# EasyEDA Pro project lubancat_extand.eprj

# Schematic Schematic1
Create Date: 2024-06-27; Page Name: P1; Project Name: lubancat_extand; Schematic Name: Schematic1; Update Date: 2024-06-27; Company: 嘉立创EDA; Page Size: A4; Version: V1.0
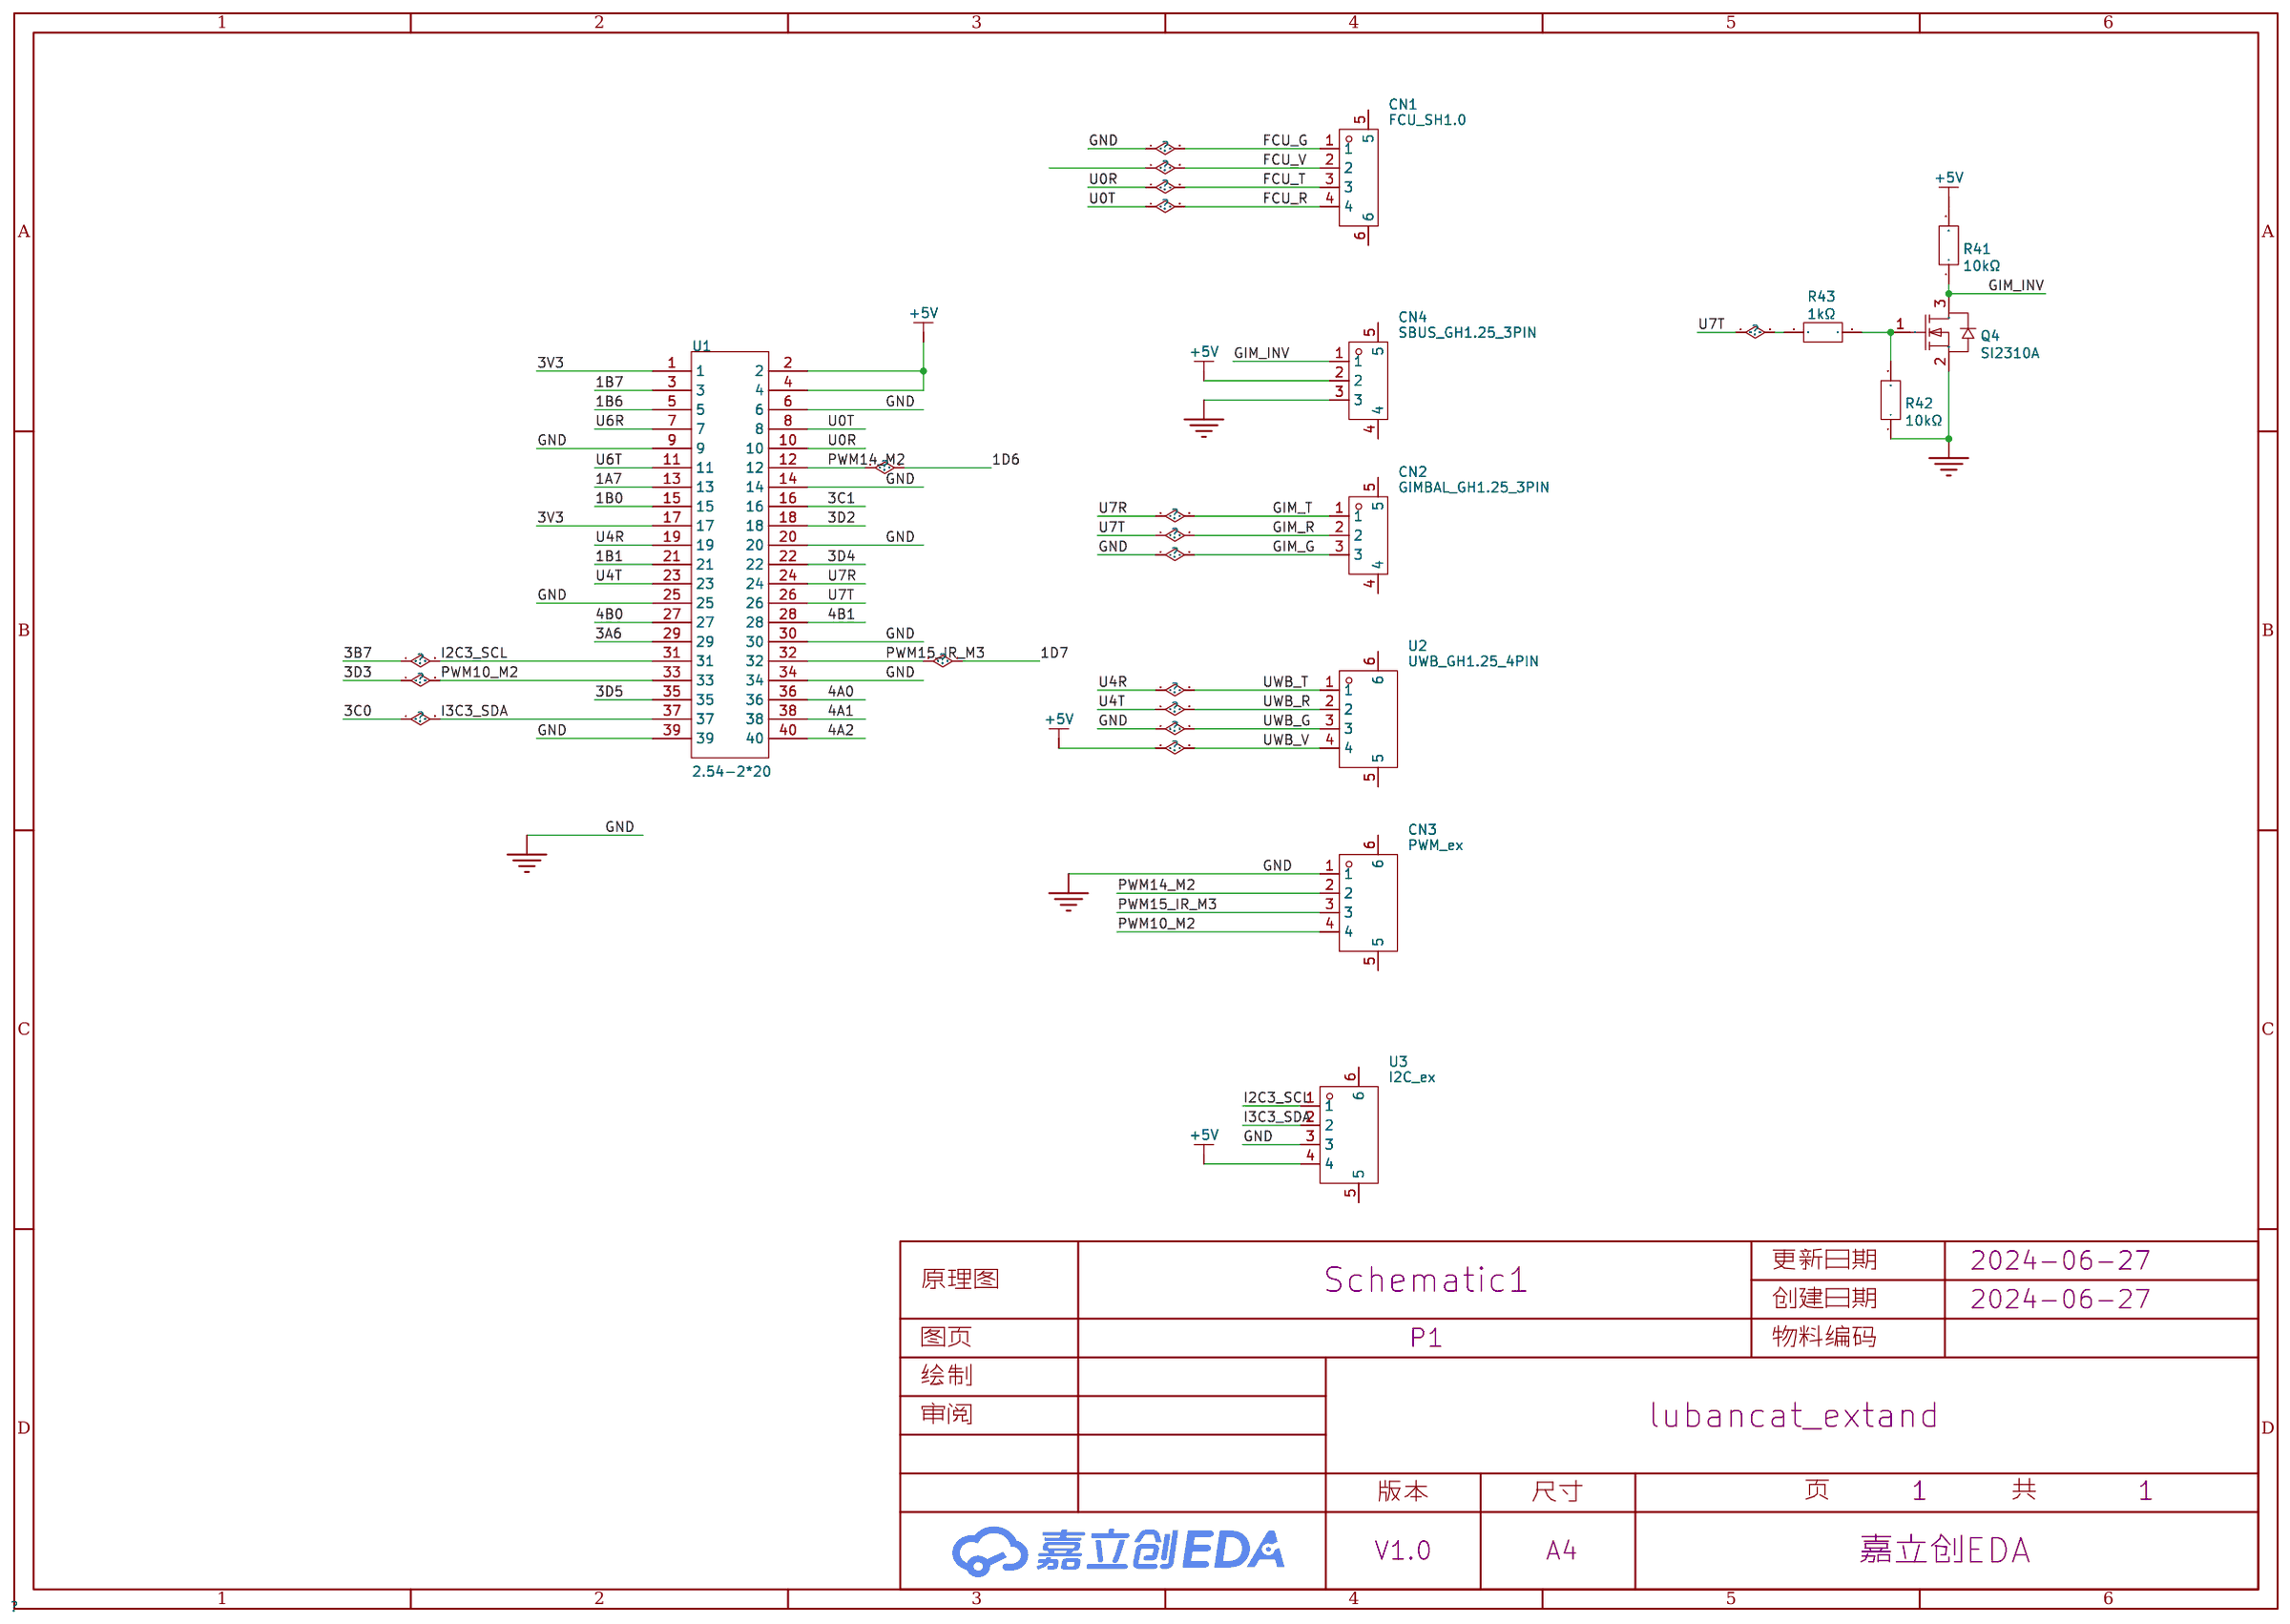
[diagram p0: schematic sheet]

## Parts
CN1  FCU_SH1.0  [CONN-SMD_4P-P1.00_WAFER-SH1.0-4PWB]
CN2  GIMBAL_GH1.25_3PIN  [CONN-TH_3P-P1.25_GH1.25]
CN3  PWM_ex  [CONN-SMD_4P-P1.25_XUNPU_WAFER-GH1.25-4PWB]
CN4  SBUS_GH1.25_3PIN  [CONN-TH_3P-P1.25_GH1.25]
Q4  SI2310A  [SOT-23-3_L2.9-W1.3-P0.95-LS2.4-BR]
R41  10kΩ  [R0603]
R42  10kΩ  [R0603]
R43  1kΩ  [R0603]
U1  2.54-2*20  [HDR-TH_40P-P2.54-V-F-R2-C20-S2.54]
U2  UWB_GH1.25_4PIN  [CONN-SMD_4P-P1.25_XUNPU_WAFER-GH1.25-4PWB]
U3  I2C_ex  [CONN-SMD_4P-P1.25_XUNPU_WAFER-GH1.25-4PWB]

## Library data of the parts
CN1 = WAFER-SH1.0-4PWB: 插针结构:1x4P;间距:1mm;安装方式:卧贴;总PIN数:4P;排数:1;每排PIN数:4;额定电流:1A;工作温度范围:-25℃~+85℃;; LCSC Part Name: 1x4P 间距:1mm 卧贴; Supplier Part: C3029343; Manufacturer: XUNPU(讯普); Supplier Footprint: SMD,P=1mm,卧贴; JLCPCB Part Class: 扩展库; Datasheet: https://atta.szlcsc.com/upload/public/pdf/source/20220527/1879B8210BD3B2006BCEAC1A40D397B6.pdf; Supplier: LCSC; Pins Structure: 1x4P; Pitch: 1mm; Mounting Style: 卧贴; Number of Pins: 4P; Number of Rows: 1; Number of PINs Per Row: 4; Current Rating (Max): 1A; Operating Temperature Range: -25℃~+85℃
CN2 CN4 = WAFER-GH1.25-3PWB: 插针结构:1x3P;间距:1.25mm;安装方式:卧贴;参考系列:GH;总PIN数:3P;排数:1;每排PIN数:3;额定电流:1A;工作温度范围:-25℃~+85℃;; LCSC Part Name: 1x3P 间距:1.25mm 卧贴 系列:GH; Supplier Part: C3029378; Manufacturer: XUNPU(讯普); Supplier Footprint: SMD,P=1.25mm,卧贴; JLCPCB Part Class: Extended Part; Datasheet: https://atta.szlcsc.com/upload/public/pdf/source/20220527/CB8773BFB0913C3B8ABD62CB38BA101A.pdf; Supplier: LCSC; Pins Structure: 1x3P; Pitch: 1.25mm; Mounting Style: 卧贴; Reference Series: GH; Number of Pins: 3P; Number of Rows: 1; Number of PINs Per Row: 3; Current Rating (Max): 1A; Operating Temperature Range: -25℃~+85℃
CN3 U2 U3 = WAFER-GH1.25-4PWB: 插针结构:1x4P;间距:1.25mm;安装方式:卧贴;参考系列:GH;总PIN数:4P;排数:1;每排PIN数:4;额定电流:1A;工作温度范围:-25℃~+85℃;; LCSC Part Name: 1x4P 间距:1.25mm 卧贴 系列:GH; Supplier Part: C3029379; Manufacturer: XUNPU(讯普); Supplier Footprint: SMD,P=1.25mm,卧贴; JLCPCB Part Class: 扩展库; Datasheet: https://atta.szlcsc.com/upload/public/pdf/source/20220527/CB8773BFB0913C3B8ABD62CB38BA101A.pdf; Supplier: LCSC; Pins Structure: 1x4P; Pitch: 1.25mm; Mounting Style: 卧贴; Reference Series: GH; Number of Pins: 4P; Number of Rows: 1; Number of PINs Per Row: 4; Current Rating (Max): 1A; Operating Temperature Range: -25℃~+85℃
Q4 = SI2310A: 类型:1个N沟道;漏源电压(Vdss):60V;连续漏极电流(Id):3A;功率(Pd):1.38W;导通电阻(RDS(on)@Vgs,Id):90mΩ@10V,3A;阈值电压(Vgs(th)@Id):3V@250uA;; LCSC Part Name: 1个N沟道 耐压:60V 电流:3A; Supplier Part: C347492; Manufacturer: UMW(友台半导体); Supplier Footprint: SOT-23; JLCPCB Part Class: Extended Part; Datasheet: https://atta.szlcsc.com/upload/public/pdf/source/20231109/99F3F4A41A969ECE105DCC94D74FAC1A.pdf; Supplier: LCSC; Type: 1个N沟道; Drain Source Voltage (Vdss): 60V; Continuous Drain Current (Id): 3A; Power Dissipation (Pd): 1.38W; Drain Source On Resistance (RDS(on)@Vgs,Id): 90mΩ@10V,3A; Gate Threshold Voltage (Vgs(th)@Id): 3V@250uA
R41 R42 = RC0603FR-0710KL: 电阻类型:厚膜电阻;阻值:10kΩ;精度:±1%;功率:100mW;最大工作电压:75V;温度系数:±100ppm/℃;; LCSC Part Name: 厚膜电阻 10kΩ ±1% 100mW; Supplier Part: C98220; Manufacturer: YAGEO(国巨); Supplier Footprint: 0603; JLCPCB Part Class: Extended Part; Datasheet: https://atta.szlcsc.com/upload/public/pdf/source/20180927/C295883_E8D83085EA81BD7DE0B2B681138C15EE.pdf; Supplier: LCSC; Type: 厚膜电阻; Tolerance: ±1%; Power(Watts): 100mW; Overload Voltage (Max): 75V; Temperature Coefficient: ±100ppm/℃; Operating Temperature Range: -55℃~+155℃
R43 = RC0603FR-071KL: 电阻类型:厚膜电阻;阻值:1kΩ;精度:±1%;功率:100mW;最大工作电压:75V;温度系数:±100ppm/℃;; LCSC Part Name: 厚膜电阻 1kΩ ±1% 100mW; Supplier Part: C22548; Manufacturer: YAGEO(国巨); Supplier Footprint: 0603; JLCPCB Part Class: Extended Part; Datasheet: https://atta.szlcsc.com/upload/public/pdf/source/20180316/70C0E2BDAE7FCC62C531A5A58D202EE1.pdf; Supplier: LCSC; Type: 厚膜电阻; Tolerance: ±1%; Power(Watts): 100mW; Overload Voltage (Max): 75V; Temperature Coefficient: ±100ppm/℃; Operating Temperature Range: -55℃~+155℃
U1 = 2.54-2*20: 插孔结构:2x20P;间距:2.54mm;行距:2.54mm;圆孔/方孔:方孔;安装类型:直插;排数:双排;总孔位数:40P;额定电流:2.5A;额定电压:-;插孔方向:顶部;塑高:8.5mm;工作温度范围:-40℃~+105℃;; LCSC Part Name: 间距:2.54mm 2x20P 直插; Supplier Part: C2977589; Manufacturer: ZHOURI(洲日); Supplier Footprint: 插件,P=2.54mm; JLCPCB Part Class: 扩展库; Datasheet: https://atta.szlcsc.com/upload/public/pdf/source/20220328/834E302BE3C038BBC5C70F5E02589B1E.pdf; Supplier: LCSC; Holes Structure: 2x20P; Pitch: 2.54mm; Row Spacing: 2.54mm; Circular Hole / Square Hole: 方孔; Mounting Type: 直插; Number of Rows: 双排; Number of Holes: 40P; Current Rating (Max): 2.5A; Holes Direction: 顶部; Insulation Height: 8.5mm; Operating Temperature Range: -40℃~+105℃

## Nets
3V3: U1.1 U1.17
+5V: CN4.2 R41.2 U1.2 U1.4 U2.4 U3.4
GND: CN1.1 CN2.3 CN3.1 CN4.3 Q4.2(S) R42.1 U1.6 U1.9 U1.14 U1.20 U1.25 U1.30 U1.34 U1.39 U2.3 U3.3
1A7: U1.13
1B0: U1.15
1B1: U1.21
1B6: U1.5
1B7: U1.3
1D6: CN3.2 U1.12
1D7: CN3.3 U1.32
3A6: U1.29
3B7: U1.31 U3.1
3C0: U1.37 U3.2
3C1: U1.16
3D2: U1.18
3D3: CN3.4 U1.33
3D4: U1.22
3D5: U1.35
4A0: U1.36
4A1: U1.38
4A2: U1.40
4B0: U1.27
4B1: U1.28
FCU_R: CN1.4 U1.8
FCU_T: CN1.3 U1.10
FCU_V: CN1.2
GIM_INV: CN4.1 Q4.3(D) R41.1
GIM_R: CN2.2 R43.2 U1.26
GIM_T: CN2.1 U1.24
U4R: U1.19 U2.1
U4T: U1.23 U2.2
U6R: U1.7
U6T: U1.11
$1N2704: Q4.1(G) R42.2 R43.1

Not connected (* = marked no-connect by the designer): CN1 5 6; CN2 4 5; CN3 5 6; CN4 4 5; U2 5 6; U3 5 6

# Schematic Schematic1_1
Create Date: 2024-06-27; Page Name: P1; Project Name: lubancat_extand; Schematic Name: Schematic1; Update Date: 2024-06-27; Company: 嘉立创EDA; Page Size: A4; Version: V1.0
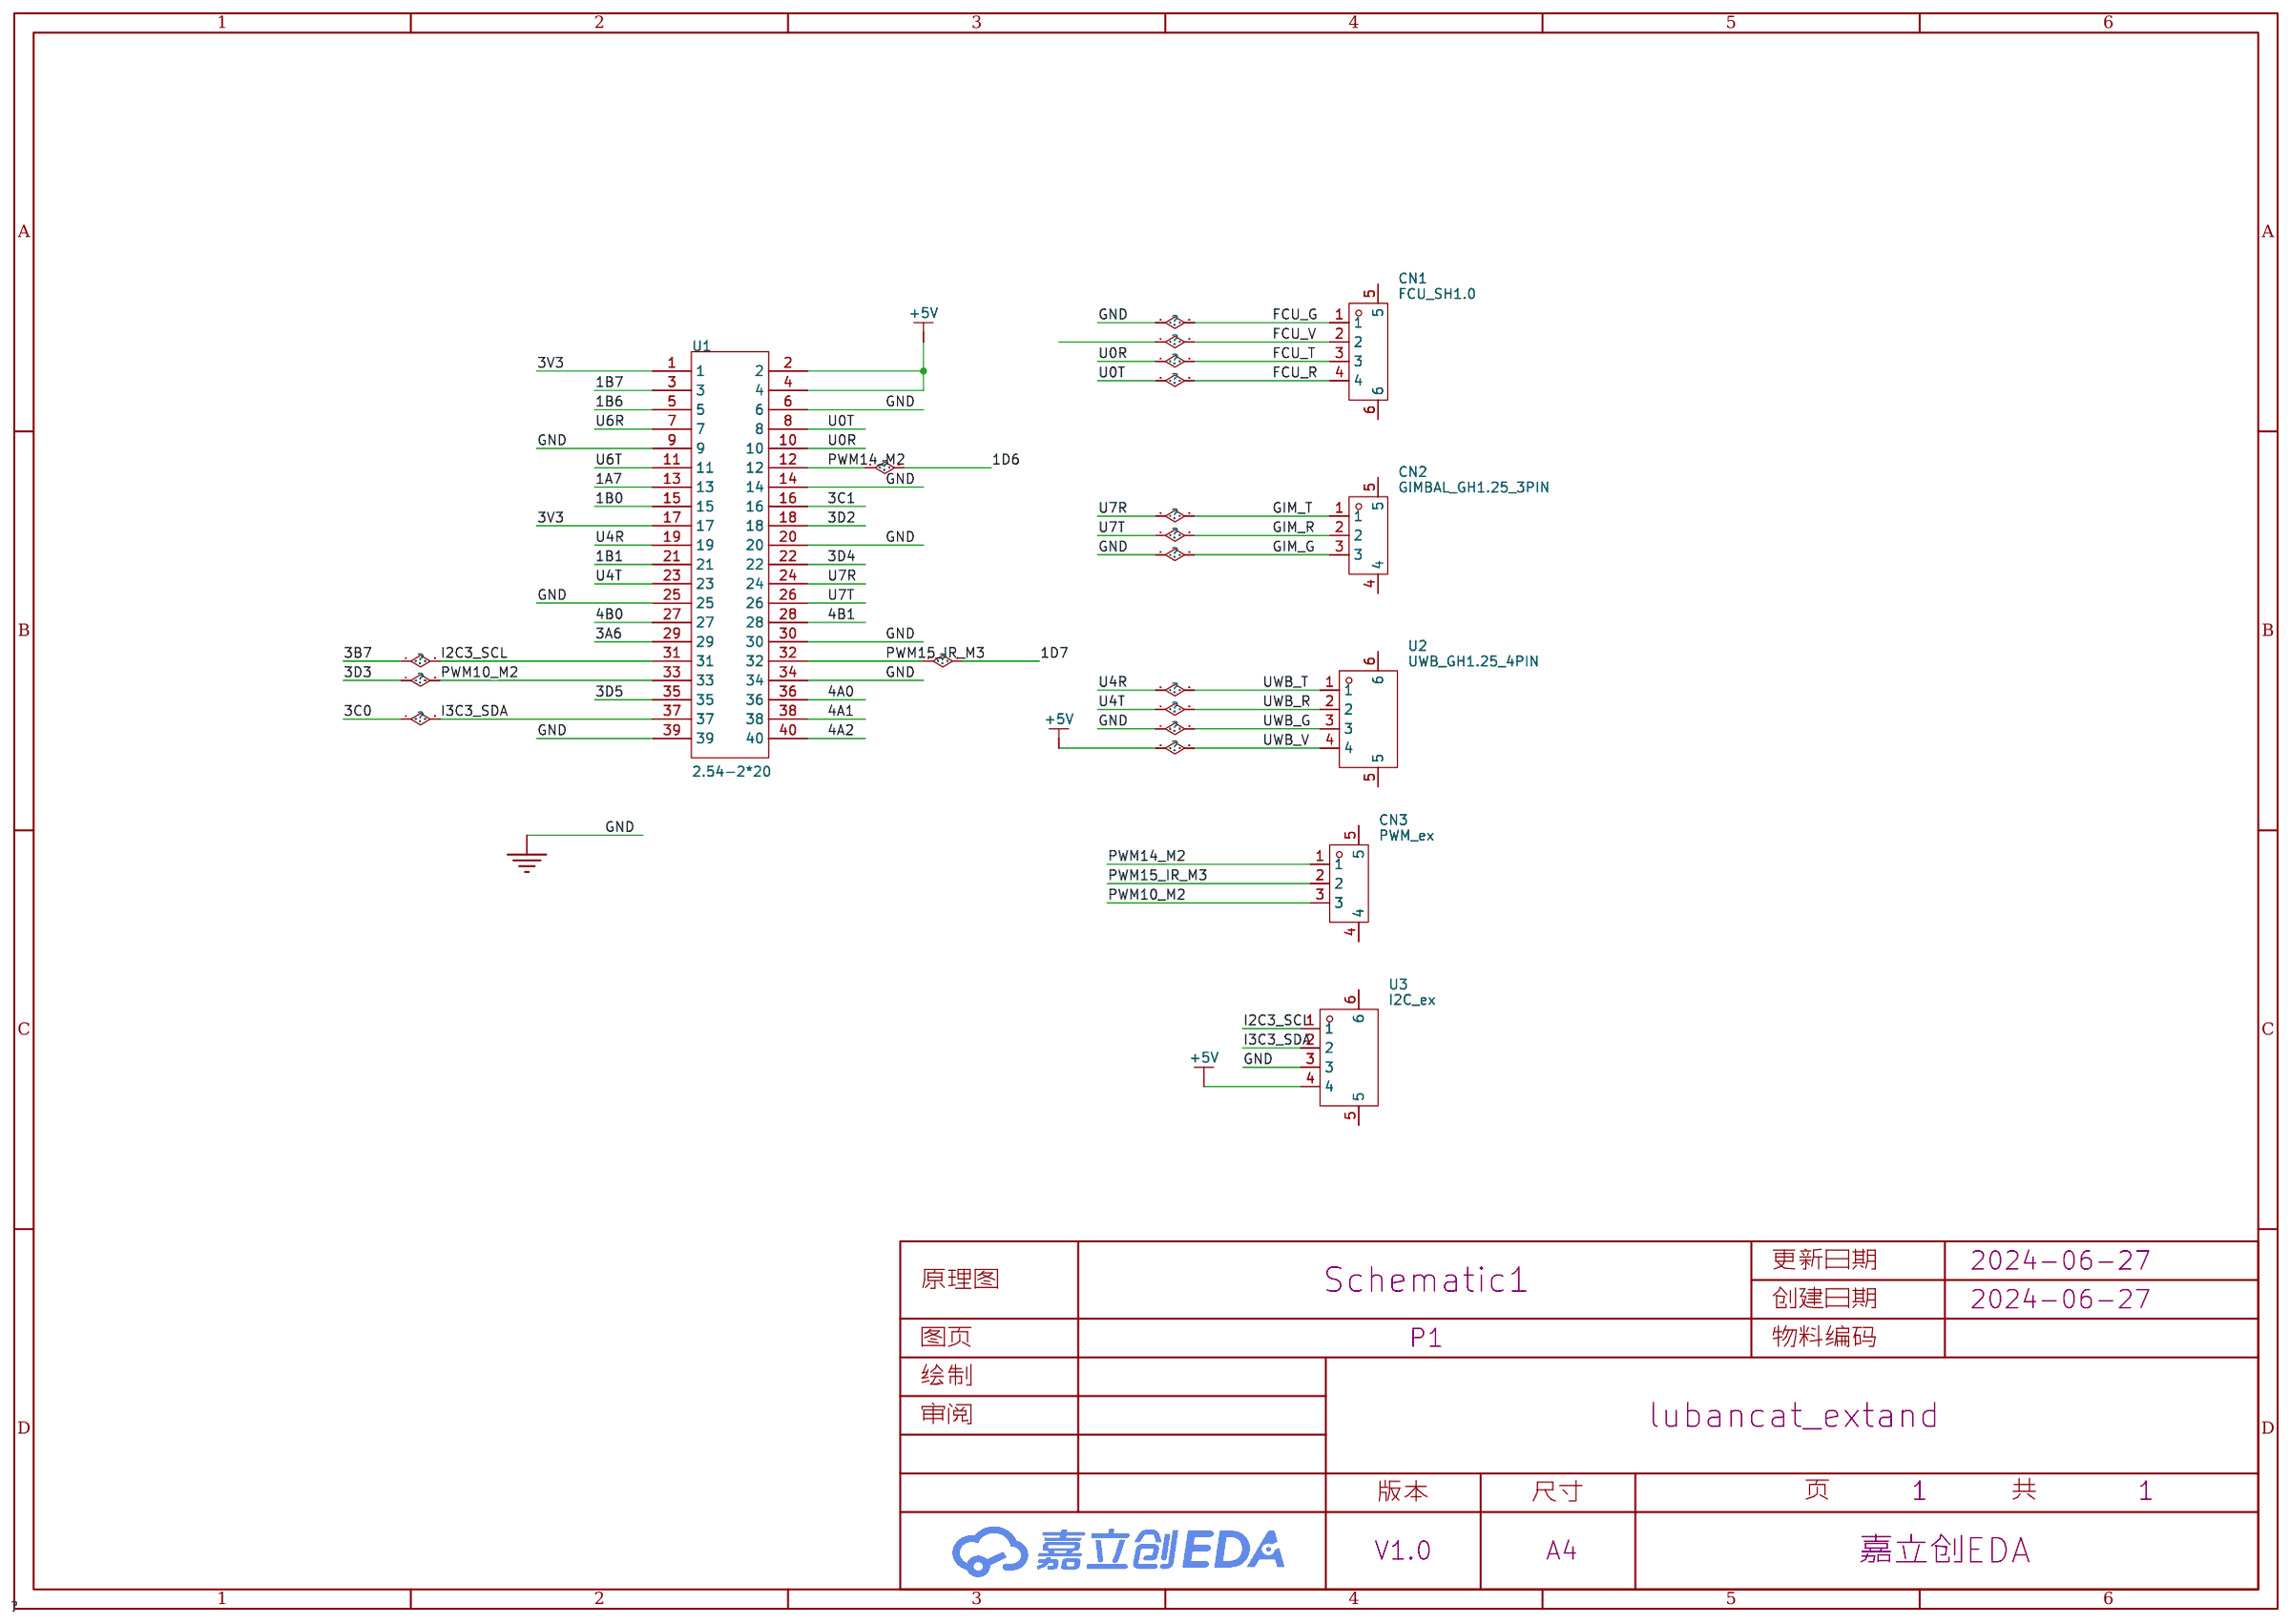
[diagram p1: schematic sheet]

## Parts
CN1  FCU_SH1.0  [CONN-SMD_4P-P1.00_WAFER-SH1.0-4PWB]
CN2  GIMBAL_GH1.25_3PIN  [CONN-TH_3P-P1.25_GH1.25]
CN3  PWM_ex  [CONN-TH_3P-P1.25_GH1.25]
U1  2.54-2*20  [HDR-TH_40P-P2.54-V-F-R2-C20-S2.54]
U2  UWB_GH1.25_4PIN  [CONN-SMD_4P-P1.25_XUNPU_WAFER-GH1.25-4PWB]
U3  I2C_ex  [CONN-SMD_4P-P1.25_XUNPU_WAFER-GH1.25-4PWB]

## Library data of the parts
CN1 = WAFER-SH1.0-4PWB: 插针结构:1x4P;间距:1mm;安装方式:卧贴;总PIN数:4P;排数:1;每排PIN数:4;额定电流:1A;工作温度范围:-25℃~+85℃;; LCSC Part Name: 1x4P 间距:1mm 卧贴; Supplier Part: C3029343; Manufacturer: XUNPU(讯普); Supplier Footprint: SMD,P=1mm,卧贴; JLCPCB Part Class: 扩展库; Datasheet: https://atta.szlcsc.com/upload/public/pdf/source/20220527/1879B8210BD3B2006BCEAC1A40D397B6.pdf; Supplier: LCSC; Pins Structure: 1x4P; Pitch: 1mm; Mounting Style: 卧贴; Number of Pins: 4P; Number of Rows: 1; Number of PINs Per Row: 4; Current Rating (Max): 1A; Operating Temperature Range: -25℃~+85℃
CN2 CN3 = WAFER-GH1.25-3PWB: 插针结构:1x3P;间距:1.25mm;安装方式:卧贴;参考系列:GH;总PIN数:3P;排数:1;每排PIN数:3;额定电流:1A;工作温度范围:-25℃~+85℃;; LCSC Part Name: 1x3P 间距:1.25mm 卧贴 系列:GH; Supplier Part: C3029378; Manufacturer: XUNPU(讯普); Supplier Footprint: SMD,P=1.25mm,卧贴; JLCPCB Part Class: Extended Part; Datasheet: https://atta.szlcsc.com/upload/public/pdf/source/20220527/CB8773BFB0913C3B8ABD62CB38BA101A.pdf; Supplier: LCSC; Pins Structure: 1x3P; Pitch: 1.25mm; Mounting Style: 卧贴; Reference Series: GH; Number of Pins: 3P; Number of Rows: 1; Number of PINs Per Row: 3; Current Rating (Max): 1A; Operating Temperature Range: -25℃~+85℃
U1 = 2.54-2*20: 插孔结构:2x20P;间距:2.54mm;行距:2.54mm;圆孔/方孔:方孔;安装类型:直插;排数:双排;总孔位数:40P;额定电流:2.5A;额定电压:-;插孔方向:顶部;塑高:8.5mm;工作温度范围:-40℃~+105℃;; LCSC Part Name: 间距:2.54mm 2x20P 直插; Supplier Part: C2977589; Manufacturer: ZHOURI(洲日); Supplier Footprint: 插件,P=2.54mm; JLCPCB Part Class: 扩展库; Datasheet: https://atta.szlcsc.com/upload/public/pdf/source/20220328/834E302BE3C038BBC5C70F5E02589B1E.pdf; Supplier: LCSC; Holes Structure: 2x20P; Pitch: 2.54mm; Row Spacing: 2.54mm; Circular Hole / Square Hole: 方孔; Mounting Type: 直插; Number of Rows: 双排; Number of Holes: 40P; Current Rating (Max): 2.5A; Holes Direction: 顶部; Insulation Height: 8.5mm; Operating Temperature Range: -40℃~+105℃
U2 U3 = WAFER-GH1.25-4PWB: 插针结构:1x4P;间距:1.25mm;安装方式:卧贴;参考系列:GH;总PIN数:4P;排数:1;每排PIN数:4;额定电流:1A;工作温度范围:-25℃~+85℃;; LCSC Part Name: 1x4P 间距:1.25mm 卧贴 系列:GH; Supplier Part: C3029379; Manufacturer: XUNPU(讯普); Supplier Footprint: SMD,P=1.25mm,卧贴; JLCPCB Part Class: 扩展库; Datasheet: https://atta.szlcsc.com/upload/public/pdf/source/20220527/CB8773BFB0913C3B8ABD62CB38BA101A.pdf; Supplier: LCSC; Pins Structure: 1x4P; Pitch: 1.25mm; Mounting Style: 卧贴; Reference Series: GH; Number of Pins: 4P; Number of Rows: 1; Number of PINs Per Row: 4; Current Rating (Max): 1A; Operating Temperature Range: -25℃~+85℃

## Nets
3V3: U1.1 U1.17
+5V: U1.2 U1.4 U2.4 U3.4
GND: CN1.1 CN2.3 U1.6 U1.9 U1.14 U1.20 U1.25 U1.30 U1.34 U1.39 U2.3 U3.3
1A7: U1.13
1B0: U1.15
1B1: U1.21
1B6: U1.5
1B7: U1.3
1D6: CN3.1 U1.12
1D7: CN3.2 U1.32
3A6: U1.29
3B7: U1.31 U3.1
3C0: U1.37 U3.2
3C1: U1.16
3D2: U1.18
3D3: CN3.3 U1.33
3D4: U1.22
3D5: U1.35
4A0: U1.36
4A1: U1.38
4A2: U1.40
4B0: U1.27
4B1: U1.28
FCU_R: CN1.4 U1.8
FCU_T: CN1.3 U1.10
FCU_V: CN1.2
GIM_R: CN2.2 U1.26
GIM_T: CN2.1 U1.24
U4R: U1.19 U2.1
U4T: U1.23 U2.2
U6R: U1.7
U6T: U1.11

Not connected (* = marked no-connect by the designer): CN1 5 6; CN2 4 5; CN3 4 5; U2 5 6; U3 5 6

# Schematic Schematic1_2
Create Date: 2024-07-09; Page Name: P1; Project Name: lubancat_extand; Schematic Name: Schematic1_2; Update Date: 2024-07-09; Company: 嘉立创EDA; Page Size: A4; Version: V1.0
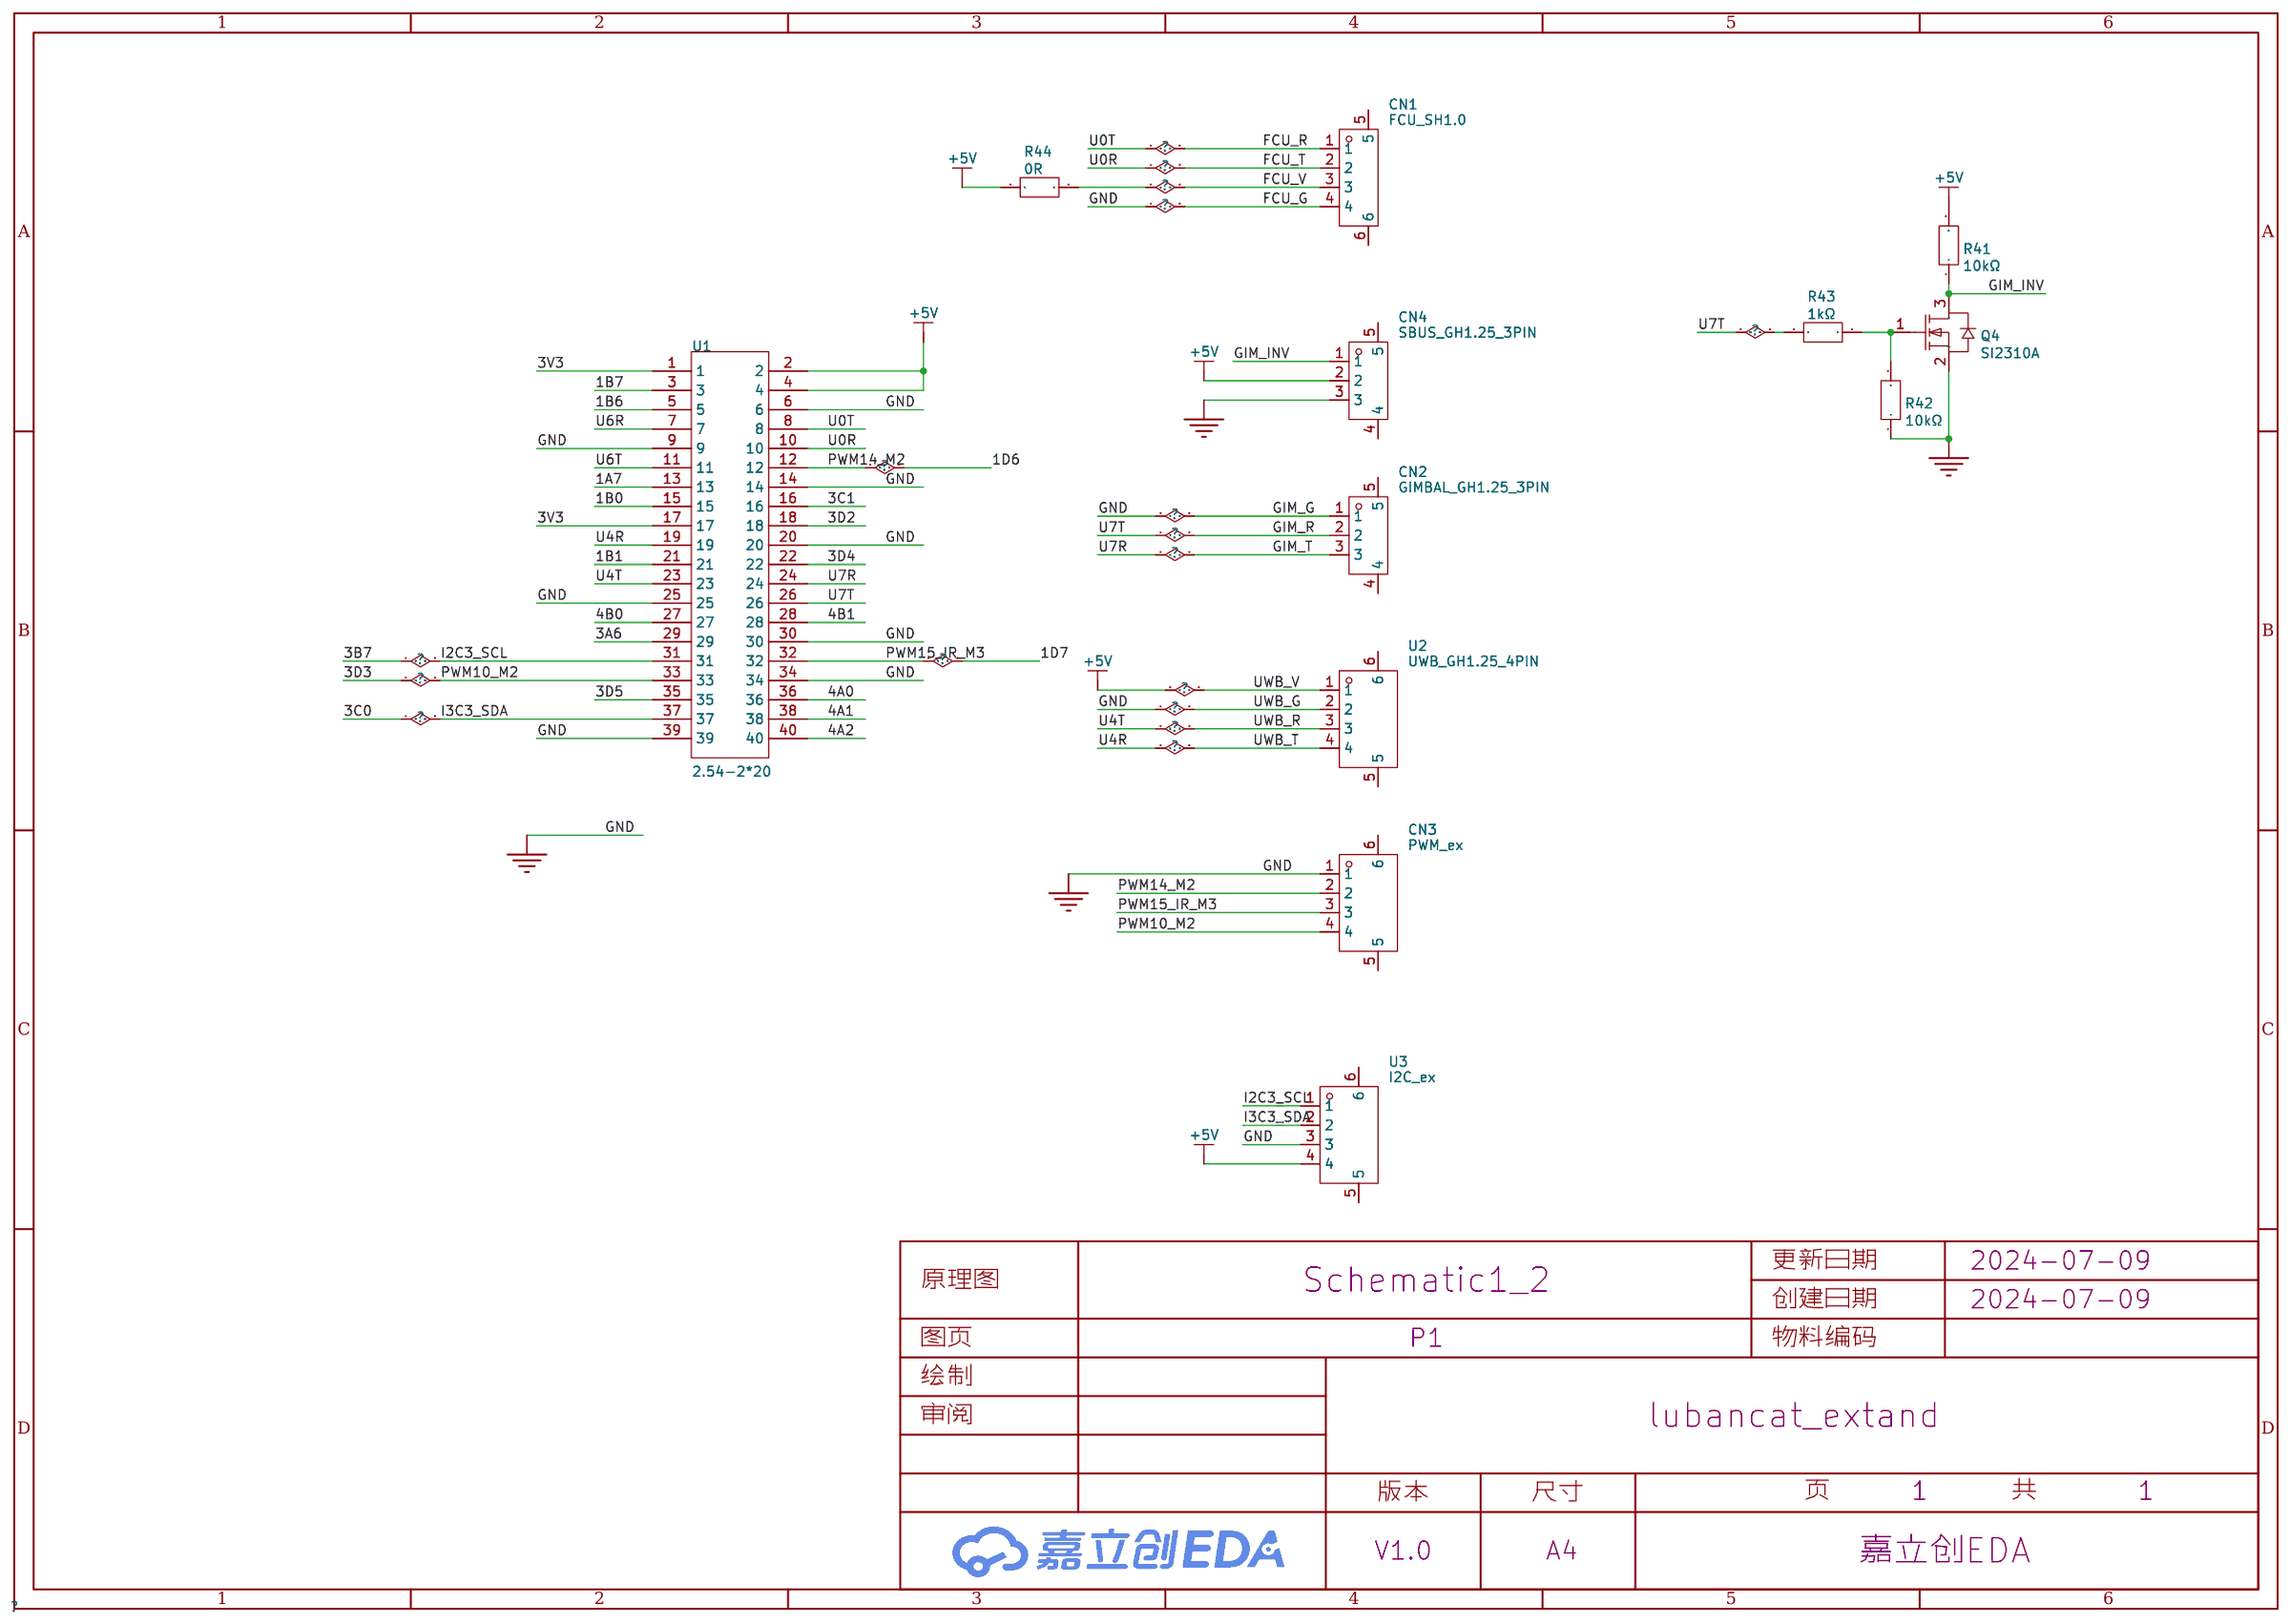
[diagram p2: schematic sheet]

## Parts
CN1  FCU_SH1.0  [CONN-SMD_4P-P1.00_WAFER-SH1.0-4PWB]
CN2  GIMBAL_GH1.25_3PIN  [CONN-TH_3P-P1.25_GH1.25]
CN3  PWM_ex  [CONN-SMD_4P-P1.25_XUNPU_WAFER-GH1.25-4PWB]
CN4  SBUS_GH1.25_3PIN  [CONN-TH_3P-P1.25_GH1.25]
Q4  SI2310A  [SOT-23-3_L2.9-W1.3-P0.95-LS2.4-BR]
R41  10kΩ  [R0805]
R42  10kΩ  [R0805]
R43  1kΩ  [R0805]
R44  0R  [R0805]
U1  2.54-2*20  [HDR-TH_40P-P2.54-V-F-R2-C20-S2.54]
U2  UWB_GH1.25_4PIN  [CONN-SMD_4P-P1.25_XUNPU_WAFER-GH1.25-4PWB]
U3  I2C_ex  [CONN-SMD_4P-P1.25_XUNPU_WAFER-GH1.25-4PWB]

## Library data of the parts
CN1 = WAFER-SH1.0-4PWB: 插针结构:1x4P;间距:1mm;安装方式:卧贴;总PIN数:4P;排数:1;每排PIN数:4;额定电流:1A;工作温度范围:-25℃~+85℃;; LCSC Part Name: 1x4P 间距:1mm 卧贴; Supplier Part: C3029343; Manufacturer: XUNPU(讯普); Supplier Footprint: SMD,P=1mm,卧贴; JLCPCB Part Class: 扩展库; Datasheet: https://atta.szlcsc.com/upload/public/pdf/source/20220527/1879B8210BD3B2006BCEAC1A40D397B6.pdf; Supplier: LCSC; Pins Structure: 1x4P; Pitch: 1mm; Mounting Style: 卧贴; Number of Pins: 4P; Number of Rows: 1; Number of PINs Per Row: 4; Current Rating (Max): 1A; Operating Temperature Range: -25℃~+85℃
CN2 CN4 = WAFER-GH1.25-3PWB: 插针结构:1x3P;间距:1.25mm;安装方式:卧贴;参考系列:GH;总PIN数:3P;排数:1;每排PIN数:3;额定电流:1A;工作温度范围:-25℃~+85℃;; LCSC Part Name: 1x3P 间距:1.25mm 卧贴 系列:GH; Supplier Part: C3029378; Manufacturer: XUNPU(讯普); Supplier Footprint: SMD,P=1.25mm,卧贴; JLCPCB Part Class: Extended Part; Datasheet: https://atta.szlcsc.com/upload/public/pdf/source/20220527/CB8773BFB0913C3B8ABD62CB38BA101A.pdf; Supplier: LCSC; Pins Structure: 1x3P; Pitch: 1.25mm; Mounting Style: 卧贴; Reference Series: GH; Number of Pins: 3P; Number of Rows: 1; Number of PINs Per Row: 3; Current Rating (Max): 1A; Operating Temperature Range: -25℃~+85℃
CN3 U2 U3 = WAFER-GH1.25-4PWB: 插针结构:1x4P;间距:1.25mm;安装方式:卧贴;参考系列:GH;总PIN数:4P;排数:1;每排PIN数:4;额定电流:1A;工作温度范围:-25℃~+85℃;; LCSC Part Name: 1x4P 间距:1.25mm 卧贴 系列:GH; Supplier Part: C3029379; Manufacturer: XUNPU(讯普); Supplier Footprint: SMD,P=1.25mm,卧贴; JLCPCB Part Class: 扩展库; Datasheet: https://atta.szlcsc.com/upload/public/pdf/source/20220527/CB8773BFB0913C3B8ABD62CB38BA101A.pdf; Supplier: LCSC; Pins Structure: 1x4P; Pitch: 1.25mm; Mounting Style: 卧贴; Reference Series: GH; Number of Pins: 4P; Number of Rows: 1; Number of PINs Per Row: 4; Current Rating (Max): 1A; Operating Temperature Range: -25℃~+85℃
Q4 = SI2310A: 类型:1个N沟道;漏源电压(Vdss):60V;连续漏极电流(Id):3A;功率(Pd):1.38W;导通电阻(RDS(on)@Vgs,Id):90mΩ@10V,3A;阈值电压(Vgs(th)@Id):3V@250uA;; LCSC Part Name: 1个N沟道 耐压:60V 电流:3A; Supplier Part: C347492; Manufacturer: UMW(友台半导体); Supplier Footprint: SOT-23; JLCPCB Part Class: Extended Part; Datasheet: https://atta.szlcsc.com/upload/public/pdf/source/20231109/99F3F4A41A969ECE105DCC94D74FAC1A.pdf; Supplier: LCSC; Type: 1个N沟道; Drain Source Voltage (Vdss): 60V; Continuous Drain Current (Id): 3A; Power Dissipation (Pd): 1.38W; Drain Source On Resistance (RDS(on)@Vgs,Id): 90mΩ@10V,3A; Gate Threshold Voltage (Vgs(th)@Id): 3V@250uA
R41 R42 = RC0603FR-0710KL: 电阻类型:厚膜电阻;阻值:10kΩ;精度:±1%;功率:100mW;最大工作电压:75V;温度系数:±100ppm/℃;; LCSC Part Name: 厚膜电阻 10kΩ ±1% 100mW; Supplier Part: C98220; Manufacturer: YAGEO(国巨); Supplier Footprint: 0603; JLCPCB Part Class: Extended Part; Datasheet: https://atta.szlcsc.com/upload/public/pdf/source/20180927/C295883_E8D83085EA81BD7DE0B2B681138C15EE.pdf; Supplier: LCSC; Type: 厚膜电阻; Tolerance: ±1%; Power(Watts): 100mW; Overload Voltage (Max): 75V; Temperature Coefficient: ±100ppm/℃; Operating Temperature Range: -55℃~+155℃
R43 R44 = RC0603FR-071KL: 电阻类型:厚膜电阻;阻值:1kΩ;精度:±1%;功率:100mW;最大工作电压:75V;温度系数:±100ppm/℃;; LCSC Part Name: 厚膜电阻 1kΩ ±1% 100mW; Supplier Part: C22548; Manufacturer: YAGEO(国巨); Supplier Footprint: 0603; JLCPCB Part Class: Extended Part; Datasheet: https://atta.szlcsc.com/upload/public/pdf/source/20180316/70C0E2BDAE7FCC62C531A5A58D202EE1.pdf; Supplier: LCSC; Type: 厚膜电阻; Tolerance: ±1%; Power(Watts): 100mW; Overload Voltage (Max): 75V; Temperature Coefficient: ±100ppm/℃; Operating Temperature Range: -55℃~+155℃
U1 = 2.54-2*20: 插孔结构:2x20P;间距:2.54mm;行距:2.54mm;圆孔/方孔:方孔;安装类型:直插;排数:双排;总孔位数:40P;额定电流:2.5A;额定电压:-;插孔方向:顶部;塑高:8.5mm;工作温度范围:-40℃~+105℃;; LCSC Part Name: 间距:2.54mm 2x20P 直插; Supplier Part: C2977589; Manufacturer: ZHOURI(洲日); Supplier Footprint: 插件,P=2.54mm; JLCPCB Part Class: 扩展库; Datasheet: https://atta.szlcsc.com/upload/public/pdf/source/20220328/834E302BE3C038BBC5C70F5E02589B1E.pdf; Supplier: LCSC; Holes Structure: 2x20P; Pitch: 2.54mm; Row Spacing: 2.54mm; Circular Hole / Square Hole: 方孔; Mounting Type: 直插; Number of Rows: 双排; Number of Holes: 40P; Current Rating (Max): 2.5A; Holes Direction: 顶部; Insulation Height: 8.5mm; Operating Temperature Range: -40℃~+105℃

## Nets
3V3: U1.1 U1.17
+5V: CN4.2 R41.2 R44.2 U1.2 U1.4 U2.1 U3.4
GND: CN1.4 CN2.1 CN3.1 CN4.3 Q4.2(S) R42.1 U1.6 U1.9 U1.14 U1.20 U1.25 U1.30 U1.34 U1.39 U2.2 U3.3
1A7: U1.13
1B0: U1.15
1B1: U1.21
1B6: U1.5
1B7: U1.3
1D6: CN3.2 U1.12
1D7: CN3.3 U1.32
3A6: U1.29
3B7: U1.31 U3.1
3C0: U1.37 U3.2
3C1: U1.16
3D2: U1.18
3D3: CN3.4 U1.33
3D4: U1.22
3D5: U1.35
4A0: U1.36
4A1: U1.38
4A2: U1.40
4B0: U1.27
4B1: U1.28
FCU_R: CN1.1 U1.8
FCU_T: CN1.2 U1.10
FCU_V: CN1.3 R44.1
GIM_INV: CN4.1 Q4.3(D) R41.1
GIM_R: CN2.2 R43.2 U1.26
GIM_T: CN2.3 U1.24
U4R: U1.19 U2.4
U4T: U1.23 U2.3
U6R: U1.7
U6T: U1.11
$1N2704: Q4.1(G) R42.2 R43.1

Not connected (* = marked no-connect by the designer): CN1 5 6; CN2 4 5; CN3 5 6; CN4 4 5; U2 5 6; U3 5 6

# Board PCB1
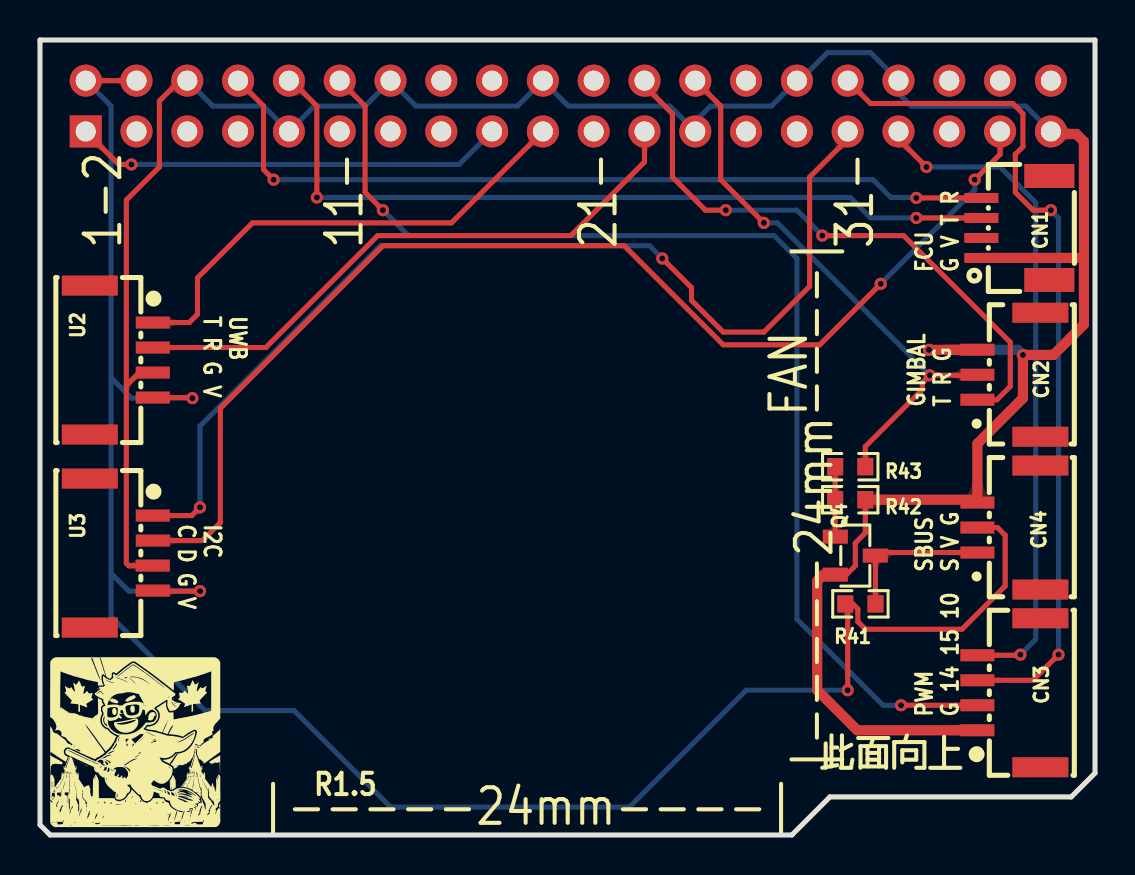
[diagram p3: board, top side]
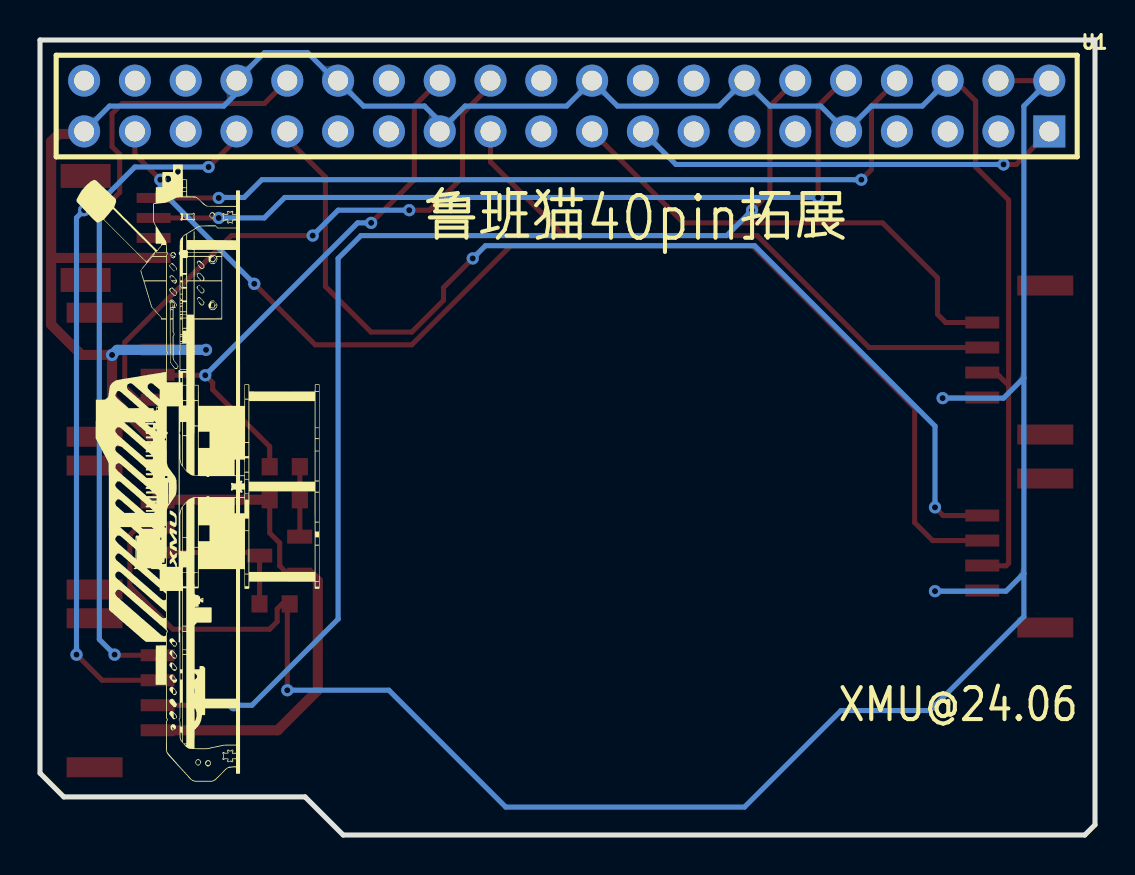
[diagram p4: board, bottom side, seen from below]

Outline 52.75 x 39.75 mm; copper layers: Top Layer, Bottom Layer. Coordinates in mm from the lower left corner of the outline.
Outline path: 0,39.75 52.75,39.75 52.75,3.09 51.56,1.91 39.5,1.91 37.59,0 0.51,0 0,0.51 0,39.75
Stack: Top Layer 0.035mm / Dielectric1 1.51mm FR4 er 4.5 / Bottom Layer 0.035mm

## Design rules (mm)
template: JLCPCB Capability(Two Layers Board)
spacing copperThickness1oz (default): track to track 0.102, other pairs 0.152 to 0.3
spacing copperThickness2oz: track to track 0.203, other pairs 0.152 to 0.3
track width copperThickness1oz (default): min 0.127, default 0.254, max 2.54
track width copperThickness2oz: min 0.203, default 0.254, max 2.54
differential pair differentialPair (default): width min 0.127, default 0.254, max 2.54; gap min 0.152, default 0.152
via viaSize (default): diameter min 0.5, default 0.61, max 10; hole min 0.3, default 0.305, max 6.3

## Placement (name value [footprint] x y rotation side)
CN1  FCU_SH1.0  [CONN-SMD_4P-P1.00_WAFER-SH1.0-4PWB]  48.77 30.35 90 top
CN2  GIMBAL_GH1.25_3PIN  [CONN-TH_3P-P1.25_GH1.25]  48.45 23.01 90 top
CN3  PWM_ex  [CONN-SMD_4P-P1.25_XUNPU_WAFER-GH1.25-4PWB]  48.45 7.11 90 top
CN4  SBUS_GH1.25_3PIN  [CONN-TH_3P-P1.25_GH1.25]  48.45 15.38 90 top
Q4  SI2310A  [SOT-23-3_L2.9-W1.3-P0.95-LS2.4-BR]  40.77 13.97 180 top
R41  10kΩ  [R0603]  41.02 11.56 180 top
R42  10kΩ  [R0603]  40.51 16.76 180 top
R43  1kΩ  [R0603]  40.51 18.42 0 top
U1  2.54-2*20  [hdr-th_40p-p2.54-v-f-r2-c20-s2.54]  26.42 36.45 180 bottom
U2  UWB_GH1.25_4PIN  [CONN-SMD_4P-P1.25_XUNPU_WAFER-GH1.25-4PWB]  4.06 23.75 270 top
U3  I2C_ex  [CONN-SMD_4P-P1.25_XUNPU_WAFER-GH1.25-4PWB]  4.06 14.1 270 top

## Footprints (pads in the part's own frame, mm; a bottom-side part is the same pattern mirrored in y, then rotated)
CONN-SMD_4P-P1.00_WAFER-SH1.0-4PWB
  rect 0.5x1.7 smd: 1(-1.5,1.7) 2(-0.5,1.7) 3(0.5,1.7) 4(1.5,1.7)
  rect 1.2x2.5 smd: 5(-2.6,-1.7) 6(2.6,-1.7)
CONN-SMD_4P-P1.25_XUNPU_WAFER-GH1.25-4PWB
  rect 0.6x1.7 smd: 1(-1.875,1.575) 2(-0.625,1.575) 3(0.625,1.575) 4(1.875,1.575)
  rect 1x2.8 smd: 5(3.725,-1.575) 6(-3.725,-1.575)
CONN-TH_3P-P1.25_GH1.25
  rect 0.6x1.7 smd: 1(-1.25,1.575) 2(0,1.575) 3(1.25,1.575)
  rect 1x2.8 smd: 4(3.1,-1.575) 5(-3.1,-1.575)
hdr-th_40p-p2.54-v-f-r2-c20-s2.54
  rect 1.6x1.6 hole 1: 1(24.13,-1.27)
  round 1.6 hole 1: 2(24.13,1.27) 3(21.59,-1.27) 4(21.59,1.27) 5(19.05,-1.27) 6(19.05,1.27) 7(16.51,-1.27) 8(16.51,1.27) 9(13.97,-1.27) 10(13.97,1.27) 11(11.43,-1.27) 12(11.43,1.27) 13(8.89,-1.27) 14(8.89,1.27) 15(6.35,-1.27) 16(6.35,1.27) 17(3.81,-1.27) 18(3.81,1.27) 19(1.27,-1.27) 20(1.27,1.27) 21(-1.27,-1.27) 22(-1.27,1.27) 23(-3.81,-1.27) 24(-3.81,1.27) 25(-6.35,-1.27) 26(-6.35,1.27) 27(-8.89,-1.27) 28(-8.89,1.27) 29(-11.43,-1.27) 30(-11.43,1.27) 31(-13.97,-1.27) 32(-13.97,1.27) 33(-16.51,-1.27) 34(-16.51,1.27) 35(-19.05,-1.27) 36(-19.05,1.27) 37(-21.59,-1.27) 38(-21.59,1.27) 39(-24.13,-1.27) 40(-24.13,1.27)
R0603
  rect 0.806x0.864 smd: 1(-0.753,0) 2(0.753,0)
SOT-23-3_L2.9-W1.3-P0.95-LS2.4-BR
  rect 1.25x0.7 smd: 1(1,-0.95) 2(1,0.95) 3(-1,0)

## Nets
As in the schematic.

Pads without a net: CN1 5 6; CN2 4 5; CN3 5 6; CN4 4 5; U2 5 6; U3 5 6

## Via types
v1: diameter 0.61, hole 0.305, Top Layer to Bottom Layer, 24 vias

## Routing (per net, layer and track width the routed paths; a pad name or vN(x,y) marks a point on that pad's centre or on a via; arc(x,y) is an arc through that point)
3V3: length 21.7
  Top Layer w0.254: 2.29,35.18 3.94,33.53 v1(4.57,33.53)
  Bottom Layer w0.254: v1(4.57,33.53) 20.95,33.53 22.61,35.18
+5V: length 105
  Top Layer w0.254: U2.4 7.59,21.87 v1(7.62,21.84) ; CN4.2 47.87,15.38 48.26,14.99 48.26,12.45 46.1,10.29 41.27,10.29 40.89,10.67 40.89,11.3 40.64,11.56 R41.2 40.39,11.44 v1(40.39,7.24) ; v1(8,12.19) 5.67,12.19 U3.4 ; 2.29,37.72 4.83,37.72
  Bottom Layer w0.254: 3.56,22.86 3.56,36.45 2.29,37.72 ; 3.56,22.86 4.57,21.84 v1(7.62,21.84) ; 3.56,22.86 3.56,13.08 ; 3.56,13.08 4.44,12.19 v1(8,12.19) ; 3.56,13.08 3.56,10.92 8.25,6.22 12.7,6.22 17.53,1.4 29.46,1.4 35.31,7.24 v1(40.39,7.24)
GND: length 141
  Top Layer w0.254: 7.37,37.72 6.98,37.72 5.97,36.7 5.97,33.4 4.32,31.75 4.32,22.48 ; 4.32,22.48 4.32,13.59 4.44,13.46 5.63,13.46 U3.3 ; 4.32,22.48 4.96,23.12 U2.3 ; Q4.2 40.33,13.02 40.77,13.46 40.77,14.61 41.27,15.1 R42.1
  Top Layer w0.508: CN3.1 40.86,5.24 38.86,7.24 38.86,12.7 39.18,13.02 Q4.2 ; v1(44.45,24.26) 46.86,24.26 CN2.3 ; 52.2,28.76 52.2,25.53 50.67,24 v1(49.15,24) 49.15,21.84 46.87,19.57 CN4.3 46.73,16.76 R42.1 ; 52.2,28.76 52.2,34.67 51.82,35.05 50.67,35.05 50.55,35.18 ; 52.2,28.76 52.1,28.85 CN1.1
  Bottom Layer w0.254: 50.55,35.18 49.28,36.45 43.56,36.45 42.93,37.08 42.93,37.72 41.53,39.12 39.37,39.12 37.97,37.72 U1.30 36.58,36.45 33.53,36.45 32.77,35.69 32.77,35.18 31.5,36.45 26.42,36.45 25.15,37.72 23.88,36.45 18.8,36.45 U1.14 16.26,36.45 13.72,36.45 U1.9 11.18,36.45 8.64,36.45 7.37,37.72
  Bottom Layer w0.508: v1(44.45,24.26) 48.89,24.26 v1(49.15,24)
1D6: length 57.9
  Top Layer w0.254: CN3.2 v1(43.05,6.49) ; 14.99,37.72 16.26,36.45 16.26,32.13 v1(17.14,31.24)
  Bottom Layer w0.254: v1(43.05,6.49) 42.15,6.49 37.85,10.8 37.85,28.83 36.7,29.97 18.42,29.97 v1(17.14,31.24)
1D7: length 42.7
  Top Layer w0.254: U1.32 41.53,36.58 48.64,36.58 49.15,36.07 49.15,34.42 48.77,34.04 48.77,32.13 49.66,31.24 v1(50.55,31.24) ; CN3.3 49.65,7.74 v1(50.93,9.02)
  Bottom Layer w0.254: v1(50.55,31.24) 50.93,30.86 v1(50.93,9.02)
3B7: length 52.5
  Top Layer w0.254: U3.1 7.59,15.97 v1(8,16.38) ; U1.31 40.39,34.8 38.48,32.89 38.48,27.43 36.2,25.15 34.16,25.15 32.58,26.73 32.58,27.37 v1(31.11,28.83)
  Bottom Layer w0.254: v1(8,16.38) 8,20.45 17.02,29.46 30.48,29.46 v1(31.11,28.83)
3C0: length 59.3
  Top Layer w0.254: v1(42.04,27.56) 38.99,24.51 34.16,24.51 29.21,29.46 17.14,29.46 9.02,21.34 9.02,15.62 8.12,14.72 U3.2 ; v1(46.74,32.77) 48.01,34.04 U1.37
  Bottom Layer w0.254: v1(42.04,27.56) 46.74,32.26 v1(46.74,32.77)
3D3: length 33.6
  Top Layer w0.254: v1(49.02,9.02) 48.99,8.99 CN3.4 ; 42.93,35.18 42.93,34.8 v1(44.32,33.4)
  Bottom Layer w0.254: v1(49.02,9.02) 49.78,9.78 49.78,31.62 48.01,33.4 v1(44.32,33.4)
FCU_R: length 41.6
  Top Layer w0.254: v1(11.68,32.77) 11.18,33.27 11.18,36.45 U1.8 ; CN1.4 v1(43.81,31.85)
  Bottom Layer w0.254: 43.94,31.88 42.55,31.88 41.66,32.77 v1(11.68,32.77)
FCU_T: length 40.1
  Top Layer w0.254: U1.10 12.57,37.72 13.84,36.45 v1(13.84,31.88) ; CN1.3 v1(43.81,30.85)
  Bottom Layer w0.254: v1(13.84,31.88) 40.51,31.88 41.54,30.85 v1(43.81,30.85)
GIM_INV: length 7.6
  Top Layer w0.254: Q4.3 41.92,14.12 CN4.1 ; R41.1 41.77,13.96
GIM_R: length 28.3
  Top Layer w0.254: v1(36.2,30.61) 34.04,32.77 34.04,36.45 32.77,37.72 ; R43.2 41.27,19.42 44.12,22.27 44.12,22.61 v1(44.49,22.99) 46.84,22.99 CN2.2
  Bottom Layer w0.254: v1(44.49,22.99) 36.87,30.61 v1(36.2,30.61)
GIM_T: length 29.8
  Top Layer w0.254: v1(34.29,31.24) 33.27,31.24 31.62,32.89 31.62,36.07 30.23,37.47 U1.24 ; v1(39.12,29.97) 43.18,29.97 48.51,24.64 48.51,22.43 47.85,21.76 CN2.1
  Bottom Layer w0.254: v1(34.29,31.24) 37.85,31.24 v1(39.12,29.97)
U4R: length 24.5
  Top Layer w0.254: 25.15,35.18 20.57,30.61 10.62,30.61 7.87,27.86 7.87,26.03 7.46,25.62 U2.1
U4T: length 30
  Top Layer w0.254: U1.23 30.23,33.66 26.54,29.97 16.89,29.97 11.29,24.37 U2.2
$1N2704: length 3.5
  Top Layer w0.254: Q4.1 39.76,14.93 R42.2 R43.1

## Copper pours and planes (outline as drawn; the poured copper is in the pictures)
GND on Top Layer: 0,39.75 0,0.51 0.51,0 37.59,0 39.5,1.91 51.56,1.91 52.75,3.09 52.75,39.75
GND on Bottom Layer: 0,39.75 0,0.51 0.51,0 37.59,0 39.5,1.91 51.56,1.91 52.75,3.09 52.75,39.75

Small or netless copper shapes (teardrops, artwork), in the pictures only: 72 on Top Layer, 40 on Bottom Layer

## Text on the board
Bottom Silkscreen Layer: XMU@24.06 | 鲁班猫40pin拓展
Top Silkscreen Layer: GIMBAL / T R G | FCU / G V T R | SBUS / S V G | PWM / G 14 15 10 | I2C / C D G V | UWB / T R G V | R1.5 | 1-2 | 11- | 21- | 31- | |-----24mm----| | FAN | 此面向上

# Board PCB1_1
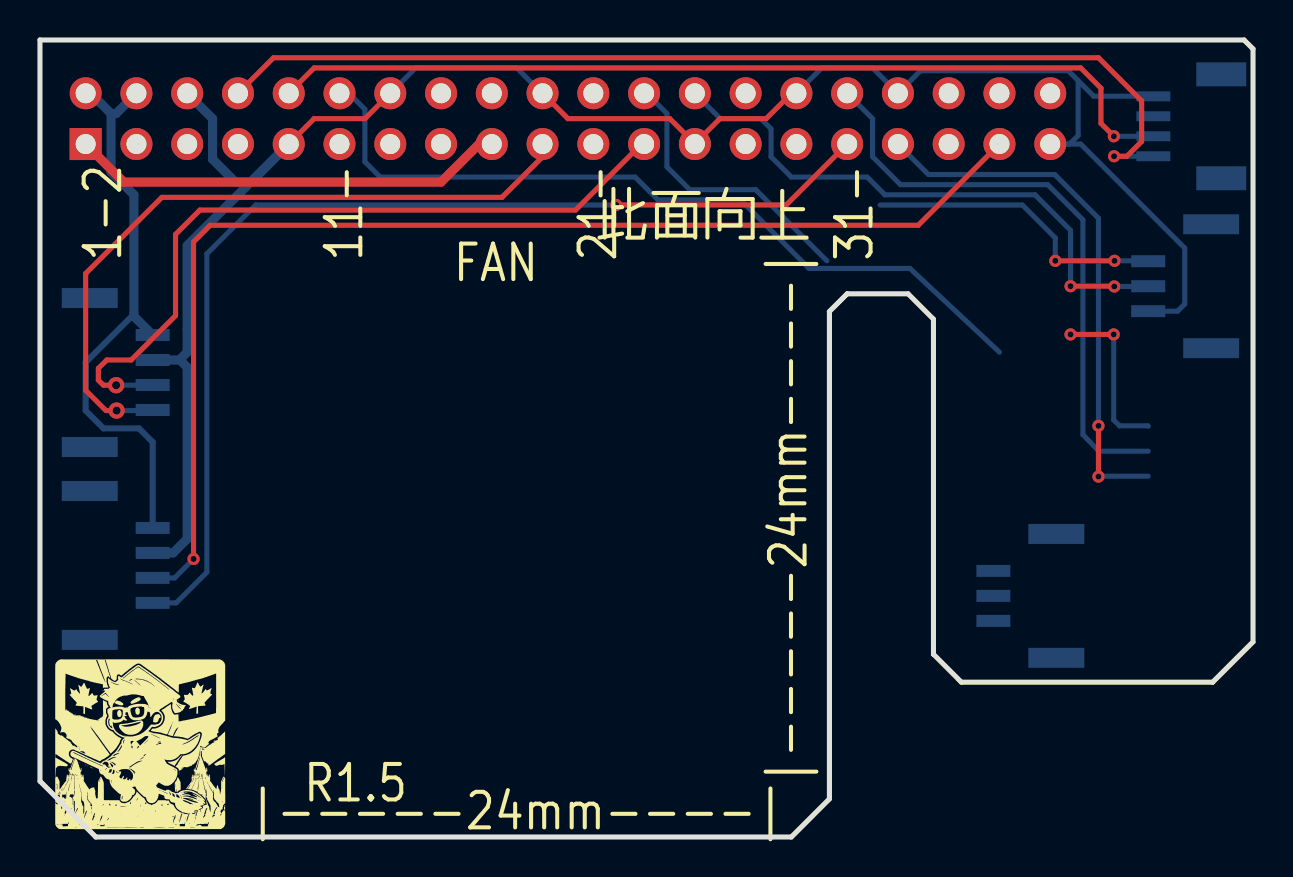
[diagram p5: board, top side]
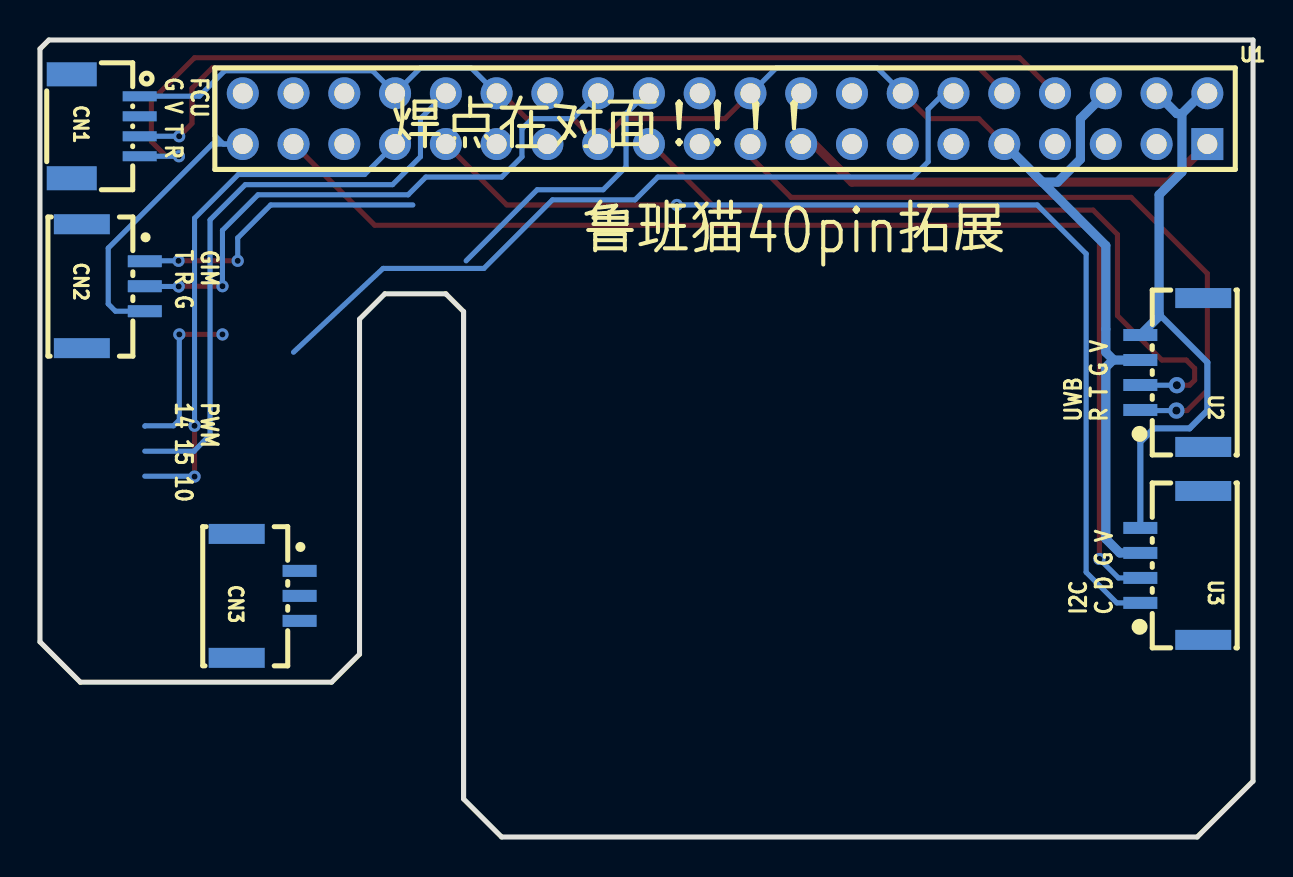
[diagram p6: board, bottom side, seen from below]

Outline 60.69 x 39.88 mm; copper layers: Top Layer, Bottom Layer. Coordinates in mm from the lower left corner of the outline.
Outline path: 0,39.88 60.24,39.88 60.69,39.43 60.69,9.77 58.67,7.75 46.1,7.75 44.7,9.14 44.7,25.91 43.43,27.18 40.39,27.18 39.5,26.29 39.5,1.91 37.59,0 2.79,0 0,2.79 0,39.88
Stack: Top Layer 0.035mm / Dielectric1 1.51mm FR4 er 4.5 / Bottom Layer 0.035mm

## Design rules (mm)
template: JLCPCB Capability(Two Layers Board)
spacing copperThickness1oz (default): track to track 0.102, other pairs 0.152 to 0.3
spacing copperThickness2oz: track to track 0.203, other pairs 0.152 to 0.3
track width copperThickness1oz (default): min 0.127, default 0.254, max 2.54
track width copperThickness2oz: min 0.203, default 0.254, max 2.54
differential pair differentialPair (default): width min 0.127, default 0.254, max 2.54; gap min 0.152, default 0.152
via viaSize (default): diameter min 0.5, default 0.61, max 10; hole min 0.3, default 0.305, max 6.3

## Placement (name value [footprint] x y rotation side)
CN1  FCU_SH1.0  [CONN-SMD_4P-P1.00_WAFER-SH1.0-4PWB]  57.4 35.56 270 bottom
CN2  GIMBAL_GH1.25_3PIN  [CONN-TH_3P-P1.25_GH1.25]  57.02 27.56 270 bottom
CN3  PWM_ex  [CONN-TH_3P-P1.25_GH1.25]  49.28 12.07 270 bottom
U1  2.54-2*20  [hdr-th_40p-p2.54-v-f-r2-c20-s2.54]  26.42 35.94 180 bottom
U2  UWB_GH1.25_4PIN  [CONN-SMD_4P-P1.25_XUNPU_WAFER-GH1.25-4PWB]  4.06 23.24 90 bottom
U3  I2C_ex  [CONN-SMD_4P-P1.25_XUNPU_WAFER-GH1.25-4PWB]  4.06 13.59 90 bottom

## Footprints (pads in the part's own frame, mm; a bottom-side part is the same pattern mirrored in y, then rotated)
CONN-SMD_4P-P1.00_WAFER-SH1.0-4PWB
  rect 0.5x1.7 smd: 1(-1.5,1.7) 2(-0.5,1.7) 3(0.5,1.7) 4(1.5,1.7)
  rect 1.2x2.5 smd: 5(-2.6,-1.7) 6(2.6,-1.7)
CONN-SMD_4P-P1.25_XUNPU_WAFER-GH1.25-4PWB
  rect 0.6x1.7 smd: 1(-1.875,1.575) 2(-0.625,1.575) 3(0.625,1.575) 4(1.875,1.575)
  rect 1x2.8 smd: 5(3.725,-1.575) 6(-3.725,-1.575)
CONN-TH_3P-P1.25_GH1.25
  rect 0.6x1.7 smd: 1(-1.25,1.575) 2(0,1.575) 3(1.25,1.575)
  rect 1x2.8 smd: 4(3.1,-1.575) 5(-3.1,-1.575)
hdr-th_40p-p2.54-v-f-r2-c20-s2.54
  rect 1.6x1.6 hole 1: 1(24.13,-1.27)
  round 1.6 hole 1: 2(24.13,1.27) 3(21.59,-1.27) 4(21.59,1.27) 5(19.05,-1.27) 6(19.05,1.27) 7(16.51,-1.27) 8(16.51,1.27) 9(13.97,-1.27) 10(13.97,1.27) 11(11.43,-1.27) 12(11.43,1.27) 13(8.89,-1.27) 14(8.89,1.27) 15(6.35,-1.27) 16(6.35,1.27) 17(3.81,-1.27) 18(3.81,1.27) 19(1.27,-1.27) 20(1.27,1.27) 21(-1.27,-1.27) 22(-1.27,1.27) 23(-3.81,-1.27) 24(-3.81,1.27) 25(-6.35,-1.27) 26(-6.35,1.27) 27(-8.89,-1.27) 28(-8.89,1.27) 29(-11.43,-1.27) 30(-11.43,1.27) 31(-13.97,-1.27) 32(-13.97,1.27) 33(-16.51,-1.27) 34(-16.51,1.27) 35(-19.05,-1.27) 36(-19.05,1.27) 37(-21.59,-1.27) 38(-21.59,1.27) 39(-24.13,-1.27) 40(-24.13,1.27)

## Nets
As in the schematic.

Pads without a net: CN1 5 6; CN2 4 5; CN3 4 5; U2 5 6; U3 5 6

## Via types
v1: diameter 0.813, hole 0.406, Top Layer to Bottom Layer, 2 vias
v2: diameter 0.61, hole 0.305, Top Layer to Bottom Layer, 12 vias

## Routing (per net, layer and track width the routed paths; a pad name or vN(x,y) marks a point on that pad's centre or on a via; arc(x,y) is an arc through that point)
3V3: length 21.9
  Top Layer w0.457: 22.61,34.67 21.97,34.67 20.07,32.77 4.19,32.77 2.29,34.67
+5V: length 29.5
  Bottom Layer w0.305: U3.4 5.64,19.76 4.95,20.45 3.17,20.45 2.29,21.34 2.29,23.75 4.7,26.16
  Bottom Layer w0.457: U2.4 4.7,26.06 4.7,32.13 3.56,33.27 3.56,36.2 ; 3.56,36.2 2.54,37.21 2.29,37.21 ; 3.56,36.2 3.81,36.2 4.83,37.21
1D6: length 48
  Top Layer w0.254: v2(53.72,25.15) v2(51.56,25.15)
  Bottom Layer w0.254: 14.99,37.21 15.46,37.21 16.26,36.41 16.26,33.78 17.02,33.02 29.78,33.02 30.92,31.88 35.05,31.88 38.48,28.45 43.53,28.45 48.01,24.26 ; 53.72,25.02 53.72,20.86 54.01,20.57 55.43,20.57 55.45,20.55
3B7: length 53.6
  Top Layer w0.254: v2(28.83,31.62) 37.34,31.62 U1.31
  Bottom Layer w0.254: U3.1 6.81,11.71 8.35,13.25 8.35,29.18 10.8,31.62 v2(28.83,31.62)
3C0: length 60.7
  Top Layer w0.254: v2(7.69,13.91) 7.69,29.78 8.51,30.61 43.94,30.61 U1.37
  Bottom Layer w0.254: U3.2 6.74,12.96 v2(7.69,13.91)
3D3: length 27
  Top Layer w0.254: v2(52.96,20.57) v2(52.96,18.03)
  Bottom Layer w0.254: 42.93,34.67 44.45,33.15 50.77,33.15 52.96,30.96 v2(52.96,20.57) ; 55.45,18.05 52.92,18.05
FCU_R: length 52.5
  Top Layer w0.254: U1.8 11.68,38.99 52.96,38.99 55.12,36.83 55.12,34.8 54.38,34.06 v2(53.74,34.06)
  Bottom Layer w0.254: CN1.4 v2(53.74,34.06)
FCU_T: length 46.2
  Top Layer w0.254: U1.10 13.72,38.48 52.07,38.48 53.09,37.47 53.09,35.7 v2(53.73,35.06)
  Bottom Layer w0.254: 53.72,35.05 v2(53.73,35.06) CN1.3
GIM_R: length 29.1
  Top Layer w0.254: v2(53.75,27.55) 53.74,27.56 v2(51.56,27.56)
  Bottom Layer w0.254: 32.77,37.21 34.04,35.94 36.07,35.94 36.58,35.43 36.58,34.04 37.59,33.02 41.39,33.02 42.27,32.13 49.78,32.13 51.56,30.35 v2(51.56,27.56) ; v2(53.75,27.55) 55.43,27.55 CN2.2
GIM_T: length 29.3
  Top Layer w0.254: v2(53.76,28.83) v2(50.8,28.83)
  Bottom Layer w0.254: U1.24 30.35,37.21 31.37,36.2 31.37,33.53 32.51,32.39 35.81,32.39 39.37,28.83 ; 42.04,31.62 49.15,31.62 50.8,29.97 v2(50.8,28.83) ; 55.32,28.83 v2(53.76,28.83)
U4R: length 35.5
  Top Layer w0.254: v1(3.83,21.34) 3.3,21.34 2.29,22.35 2.29,28.19 6.1,32 23.11,32 25.15,34.04 25.15,34.67
  Bottom Layer w0.254: v1(3.83,21.34) 5.61,21.34 U2.1
U4T: length 37.7
  Top Layer w0.254: v1(3.81,22.61) 3.17,22.61 2.92,22.86 2.92,23.45 3.34,23.87 4.56,23.87 6.78,26.09 6.78,30.15 8,31.37 26.8,31.37 30.16,34.73
  Bottom Layer w0.254: U2.2 5.63,22.61 v1(3.81,22.61)
GND: length 103.1
  Top Layer w0.254: U1.9 13.72,35.94 16.26,35.94 U1.14 ; 25.15,37.21 26.42,35.94 31.51,35.94 32.77,34.69 ; 32.77,34.69 32.77,34.67 ; 32.77,34.69 34.02,35.94 36.34,35.94 37.61,37.21 U1.30
  Bottom Layer w0.254: 5.64,23.88 5.65,23.87 7,23.87 ; U1.14 18.8,38.48 23.85,38.48 25.12,37.21 ; U1.30 39.12,38.48 41.66,38.48 42.93,37.21 44.05,38.34 51.45,38.34 51.94,37.84 ; 51.94,37.84 51.94,35.1 51.51,34.67 50.55,34.67 52.07,34.67 57.28,29.46 57.28,26.67 56.92,26.31 CN2.3 ; 51.94,37.84 52.72,37.07 55.55,37.07
  Bottom Layer w0.457: 5.65,23.87 6.97,23.87 7.37,24.26 7.37,29.59 U1.9 10.54,32.77 9.78,32.77 8.64,33.91 8.64,35.94 7.37,37.21 ; U3.3 6.66,14.21 7.37,14.92 7.37,23.5 7,23.87
1D7: length 29.9
  Bottom Layer w0.254: U1.32 41.66,35.94 41.66,34.04 43.05,32.64 50.42,32.64 52.18,30.88 52.18,20.13 52.98,19.3 55.45,19.3

## Text on the board
Bottom Silkscreen Layer: I2C / C D G V | UWB / R T G V | PWM / 14 15 10 | GIM / T R G | FCU / G V T R | 鲁班猫40pin拓展 | 焊点在对面！！！！
Top Silkscreen Layer: 1-2 | 11- | 21- | 31- | R1.5 | FAN | |-----24mm----| | 此面向上

# Board PCB1_2
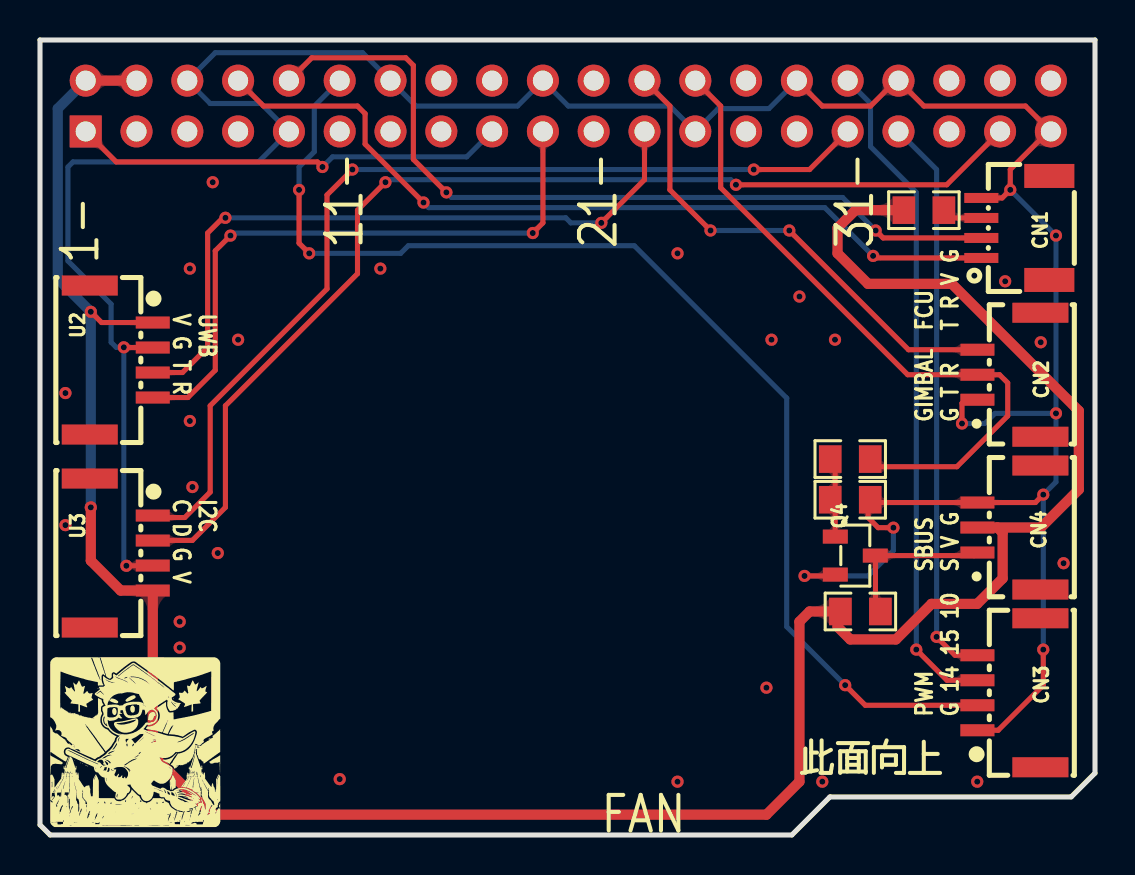
[diagram p7: board, top side]
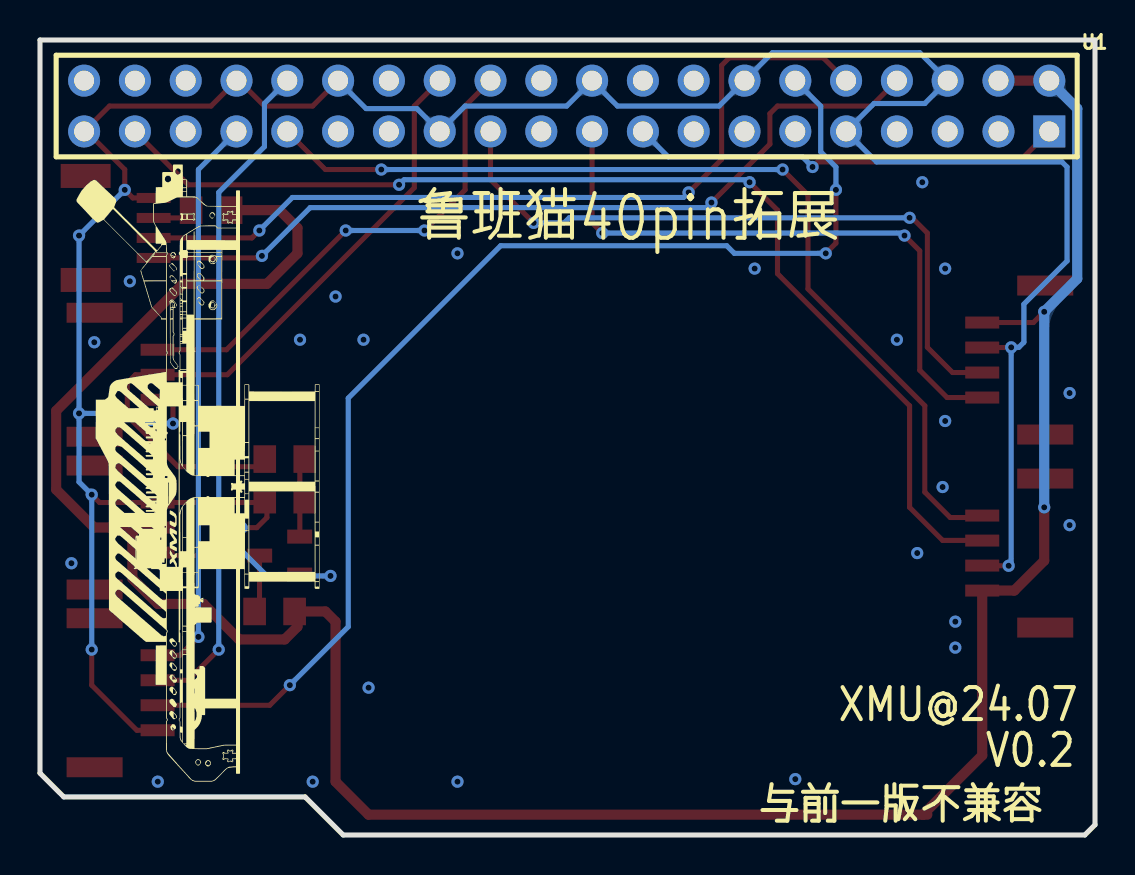
[diagram p8: board, bottom side, seen from below]

Outline 52.75 x 39.75 mm; copper layers: Top Layer, Bottom Layer. Coordinates in mm from the lower left corner of the outline.
Outline path: 0,39.75 52.75,39.75 52.75,3.09 51.56,1.91 39.5,1.91 37.59,0 0.51,0 0,0.51 0,39.75
Stack: Top Layer 0.035mm / Dielectric1 1.51mm FR4 er 4.5 / Bottom Layer 0.035mm

## Design rules (mm)
template: JLCPCB Capability(Two Layers Board)
spacing copperThickness1oz (default): track to track 0.102, other pairs 0.152 to 0.3
spacing copperThickness2oz: track to track 0.203, other pairs 0.152 to 0.3
track width copperThickness1oz (default): min 0.127, default 0.254, max 2.54
track width copperThickness2oz: min 0.203, default 0.254, max 2.54
differential pair differentialPair (default): width min 0.127, default 0.254, max 2.54; gap min 0.152, default 0.152
via viaSize (default): diameter min 0.5, default 0.61, max 10; hole min 0.3, default 0.305, max 6.3

## Placement (name value [footprint] x y rotation side)
CN1  FCU_SH1.0  [CONN-SMD_4P-P1.00_WAFER-SH1.0-4PWB]  48.77 30.35 90 top
CN2  GIMBAL_GH1.25_3PIN  [CONN-TH_3P-P1.25_GH1.25]  48.45 23.01 90 top
CN3  PWM_ex  [CONN-SMD_4P-P1.25_XUNPU_WAFER-GH1.25-4PWB]  48.45 7.11 90 top
CN4  SBUS_GH1.25_3PIN  [CONN-TH_3P-P1.25_GH1.25]  48.45 15.38 90 top
Q4  SI2310A  [SOT-23-3_L2.9-W1.3-P0.95-LS2.4-BR]  40.77 13.97 180 top
R41  10kΩ  [R0805]  41.02 11.18 180 top
R42  10kΩ  [R0805]  40.51 16.76 180 top
R43  1kΩ  [R0805]  40.51 18.8 0 top
R44  0R  [R0805]  44.2 31.24 180 top
U1  2.54-2*20  [hdr-th_40p-p2.54-v-f-r2-c20-s2.54]  26.42 36.45 180 bottom
U2  UWB_GH1.25_4PIN  [CONN-SMD_4P-P1.25_XUNPU_WAFER-GH1.25-4PWB]  4.06 23.75 270 top
U3  I2C_ex  [CONN-SMD_4P-P1.25_XUNPU_WAFER-GH1.25-4PWB]  4.06 14.1 270 top

## Footprints (pads in the part's own frame, mm; a bottom-side part is the same pattern mirrored in y, then rotated)
CONN-SMD_4P-P1.00_WAFER-SH1.0-4PWB
  rect 0.5x1.7 smd: 1(-1.5,1.7) 2(-0.5,1.7) 3(0.5,1.7) 4(1.5,1.7)
  rect 1.2x2.5 smd: 5(-2.6,-1.7) 6(2.6,-1.7)
CONN-SMD_4P-P1.25_XUNPU_WAFER-GH1.25-4PWB
  rect 0.6x1.7 smd: 1(-1.875,1.575) 2(-0.625,1.575) 3(0.625,1.575) 4(1.875,1.575)
  rect 1x2.8 smd: 5(3.725,-1.575) 6(-3.725,-1.575)
CONN-TH_3P-P1.25_GH1.25
  rect 0.6x1.7 smd: 1(-1.25,1.575) 2(0,1.575) 3(1.25,1.575)
  rect 1x2.8 smd: 4(3.1,-1.575) 5(-3.1,-1.575)
hdr-th_40p-p2.54-v-f-r2-c20-s2.54
  rect 1.6x1.6 hole 1: 1(24.13,-1.27)
  round 1.6 hole 1: 2(24.13,1.27) 3(21.59,-1.27) 4(21.59,1.27) 5(19.05,-1.27) 6(19.05,1.27) 7(16.51,-1.27) 8(16.51,1.27) 9(13.97,-1.27) 10(13.97,1.27) 11(11.43,-1.27) 12(11.43,1.27) 13(8.89,-1.27) 14(8.89,1.27) 15(6.35,-1.27) 16(6.35,1.27) 17(3.81,-1.27) 18(3.81,1.27) 19(1.27,-1.27) 20(1.27,1.27) 21(-1.27,-1.27) 22(-1.27,1.27) 23(-3.81,-1.27) 24(-3.81,1.27) 25(-6.35,-1.27) 26(-6.35,1.27) 27(-8.89,-1.27) 28(-8.89,1.27) 29(-11.43,-1.27) 30(-11.43,1.27) 31(-13.97,-1.27) 32(-13.97,1.27) 33(-16.51,-1.27) 34(-16.51,1.27) 35(-19.05,-1.27) 36(-19.05,1.27) 37(-21.59,-1.27) 38(-21.59,1.27) 39(-24.13,-1.27) 40(-24.13,1.27)
R0805
  rect 1.133x1.377 smd: 1(-1,0) 2(1,0)
SOT-23-3_L2.9-W1.3-P0.95-LS2.4-BR
  rect 1.25x0.7 smd: 1(1,-0.95) 2(1,0.95) 3(-1,0)

## Nets
As in the schematic.

Pads without a net: CN1 5 6; CN2 4 5; CN3 5 6; CN4 4 5; U2 5 6; U3 5 6

## Via types
v1: diameter 0.61, hole 0.305, Top Layer to Bottom Layer, 55 vias

## Routing (per net, layer and track width the routed paths; a pad name or vN(x,y) marks a point on that pad's centre or on a via; arc(x,y) is an arc through that point)
3V3: length 21.8
  Top Layer w0.254: v1(14.12,33.4) 13.87,33.66 3.81,33.66 2.29,35.18
  Bottom Layer w0.254: 22.61,35.18 21.34,33.91 14.63,33.91 v1(14.12,33.4)
+5V: length 130.9
  Top Layer w0.254: U2.1 3.08,25.62 v1(2.54,26.16)
  Top Layer w0.508: R44.2 40.77,31.24 39.88,30.35 39.88,29.08 41.4,27.56 45.59,27.56 51.94,21.21 51.94,17.27 50.05,15.38 47.87,15.38 ; 8.6,1.02 5.64,3.98 U3.4 4.03,12.22 2.54,13.72 v1(2.54,16.38) ; 8.6,1.02 36.32,1.02 37.97,2.67 37.97,10.67 38.48,11.18 39.88,11.18 39.88,10.41 40.51,9.78 42.8,9.78 44.58,11.56 46.86,11.56 48.13,12.83 48.13,15.11 47.87,15.38 ; 8.6,1.02 8.38,1.02 ; 47.87,15.38 CN4.2 ; 2.29,37.72 4.83,37.72
  Bottom Layer w0.508: 2.29,37.72 0.89,36.32 0.89,27.81 v1(2.54,26.16) v1(2.54,16.38)
GND: length 153.1
  Top Layer w0.254: v1(42.67,15.37) 41.91,15.37 41.41,15.87 41.41,16.62 ; U2.2 4.2,24.37 v1(4.19,24.38) ; 41.41,16.62 41.27,16.76 ; 41.41,16.62 CN4.3 49.77,16.62 v1(50.17,17.02) ; Q4.2 39.7,12.95 v1(38.23,12.95) ; CN3.1 47.91,5.24 50.17,7.49 v1(50.17,9.27) ; CN2.1 46.27,21.76 46.1,21.59 v1(46.1,20.57) ; U1.30 39.12,36.45 41.53,36.45 42.8,37.72 42.93,37.72 44.2,36.45 49.28,36.45 50.55,35.18 50.42,35.18 48.51,33.27 v1(48.51,32.26) 48.11,31.85 CN1.4 ; v1(4.32,13.46) 5.63,13.46 U3.3
  Bottom Layer w0.254: v1(46.1,20.57) 47.24,20.57 47.75,21.08 v1(50.8,21.08) ; v1(50.8,21.08) v1(50.8,29.97) v1(48.51,32.26) ; v1(50.8,21.08) 50.8,17.65 v1(50.17,17.02) v1(50.17,9.27) ; v1(42.67,15.37) 42.67,14.22 41.4,12.95 v1(38.23,12.95) ; U1.30 36.45,36.32 33.91,36.32 32.77,35.18 31.5,36.45 26.42,36.45 25.15,37.72 23.88,36.45 18.8,36.45 U1.14 16.13,39.12 8.76,39.12 7.37,37.72 8.51,36.58 11.05,36.58 U1.9 10.92,33.66 1.65,33.66 1.4,33.4 1.4,28.7 3.56,26.54 3.56,24.64 3.81,24.38 v1(4.19,24.38) 4.19,13.59 v1(4.32,13.46)
  vias: v1(1.27,22.1) v1(1.27,15.49) v1(6.98,10.67) v1(6.98,9.37) v1(7.49,28.32) v1(7.49,20.7) v1(7.62,17.4) v1(8.64,32.64) v1(8.89,14.1) v1(9.91,24.77) v1(14.99,2.79) v1(17.02,28.32) v1(31.88,29.08) v1(31.88,2.67) v1(36.32,7.37) v1(36.58,24.77) v1(37.97,26.92) v1(39.12,2.67) v1(39.75,24.77) v1(46.86,2.67) v1(48.26,27.69) v1(50.04,24.64) v1(51.18,13.59)
1D6: length 59.5
  Top Layer w0.254: v1(12.95,32.26) 12.95,29.59 v1(13.46,29.08) ; CN3.2 41.27,6.49 v1(40.26,7.49)
  Bottom Layer w0.254: 14.99,37.72 13.72,36.45 13.72,34.16 12.95,33.4 v1(12.95,32.26) ; v1(40.26,7.49) 37.34,10.41 37.34,21.84 29.72,29.46 18.42,29.46 18.03,29.08 v1(13.46,29.08)
1D7: length 33.6
  Top Layer w0.254: CN3.3 45.35,7.74 v1(43.81,9.27)
  Bottom Layer w0.254: v1(43.81,9.27) 43.81,32.13 41.53,34.42 41.53,36.58 U1.32
3B7: length 48.1
  Top Layer w0.254: U3.1 5.74,15.88 7.24,15.88 8.51,17.14 8.51,21.46 14.35,27.31 14.35,32 v1(15.62,33.27) ; U1.31 38.48,33.27 v1(35.69,33.27)
  Bottom Layer w0.254: v1(15.62,33.27) v1(35.69,33.27)
3C0: length 55.9
  Top Layer w0.254: v1(17.27,32.64) 15.87,31.24 15.87,28.07 9.27,21.46 9.27,16.38 7.62,14.73 5.65,14.73 U3.2 ; U1.37 45.34,32.51 v1(34.8,32.51)
  Bottom Layer w0.254: v1(17.27,32.64) 17.4,32.77 34.54,32.77 v1(34.8,32.51)
3D3: length 28.5
  Top Layer w0.254: v1(44.83,9.91) 45.75,8.99 CN3.4
  Bottom Layer w0.254: v1(44.83,9.91) 44.83,33.27 42.93,35.18
FCU_R: length 41.7
  Top Layer w0.254: v1(41.66,28.96) 41.76,28.85 CN1.1 ; v1(19.18,31.62) 16.26,34.54 16.26,36.07 15.87,36.45 11.18,36.45 U1.8
  Bottom Layer w0.254: v1(41.66,28.96) 39.24,31.37 19.43,31.37 v1(19.18,31.62)
FCU_T: length 41.6
  Top Layer w0.254: v1(41.78,30.23) 42.16,29.85 CN1.2 ; v1(20.32,32.13) 18.67,33.78 18.67,38.48 18.29,38.86 13.59,38.86 U1.10
  Bottom Layer w0.254: v1(20.32,32.13) 20.57,31.88 40.13,31.88 v1(41.78,30.23)
FCU_V: length 2.3
  Top Layer w0.254: CN1.3 45.33,30.85 44.94,31.24
GIM_INV: length 7.6
  Top Layer w0.254: CN4.1 46.72,13.97 Q4.3 41.77,13.96 41.77,11.56
GIM_R: length 34.1
  Top Layer w0.254: 32.77,37.72 34.04,36.45 34.04,32.36 43.39,23.01 CN2.2 47.98,23.01 48.39,22.61 48.39,20.95 45.85,18.42 41.27,18.42
GIM_T: length 24.7
  Top Layer w0.254: U1.24 31.5,36.45 31.5,32.26 v1(33.53,30.23) ; v1(37.46,30.23) 43.43,24.26 CN2.3
  Bottom Layer w0.254: v1(37.46,30.23) v1(33.53,30.23)
U4R: length 31.2
  Top Layer w0.254: U2.4 7.4,21.87 8.76,23.24 8.76,29.21 v1(9.52,29.97) ; 25.15,35.18 25.15,30.61 v1(24.64,30.1)
  Bottom Layer w0.254: v1(24.64,30.1) 9.65,30.1 v1(9.52,29.97)
U4T: length 34.6
  Top Layer w0.254: v1(28.07,30.61) 30.23,32.77 U1.23 ; U2.3 7.12,23.12 8.38,24.38 8.38,30.1 9.14,30.86 v1(9.27,30.86)
  Bottom Layer w0.254: v1(9.27,30.86) 26.29,30.86 26.54,30.61 v1(28.07,30.61)
$1N2704: length 3.5
  Top Layer w0.254: 39.76,18.42 39.76,14.93 Q4.1

## Copper pours and planes (outline as drawn; the poured copper is in the pictures)
GND on Top Layer: 0,39.75 0,0.51 0.51,0 37.59,0 39.5,1.91 51.56,1.91 52.75,3.09 52.75,39.75
GND on Bottom Layer: 0,39.75 0,0.51 0.51,0 37.59,0 39.5,1.91 51.56,1.91 52.75,3.09 52.75,39.75

Small or netless copper shapes (teardrops, artwork), in the pictures only: 88 on Top Layer, 52 on Bottom Layer

## Text on the board
Bottom Silkscreen Layer: V0.2 | XMU@24.07 | 与前一版不兼容 | 鲁班猫40pin拓展
Top Silkscreen Layer: FCU / T R V G | GIMBAL / G T R | SBUS / S V G | PWM / G 14 15 10 | UWB / V G T R | I2C / C D G V | 1- | 11- | 21- | 31- | FAN | 此面向上
